# Altium project IoT_Project_V2.1.PrjPcb
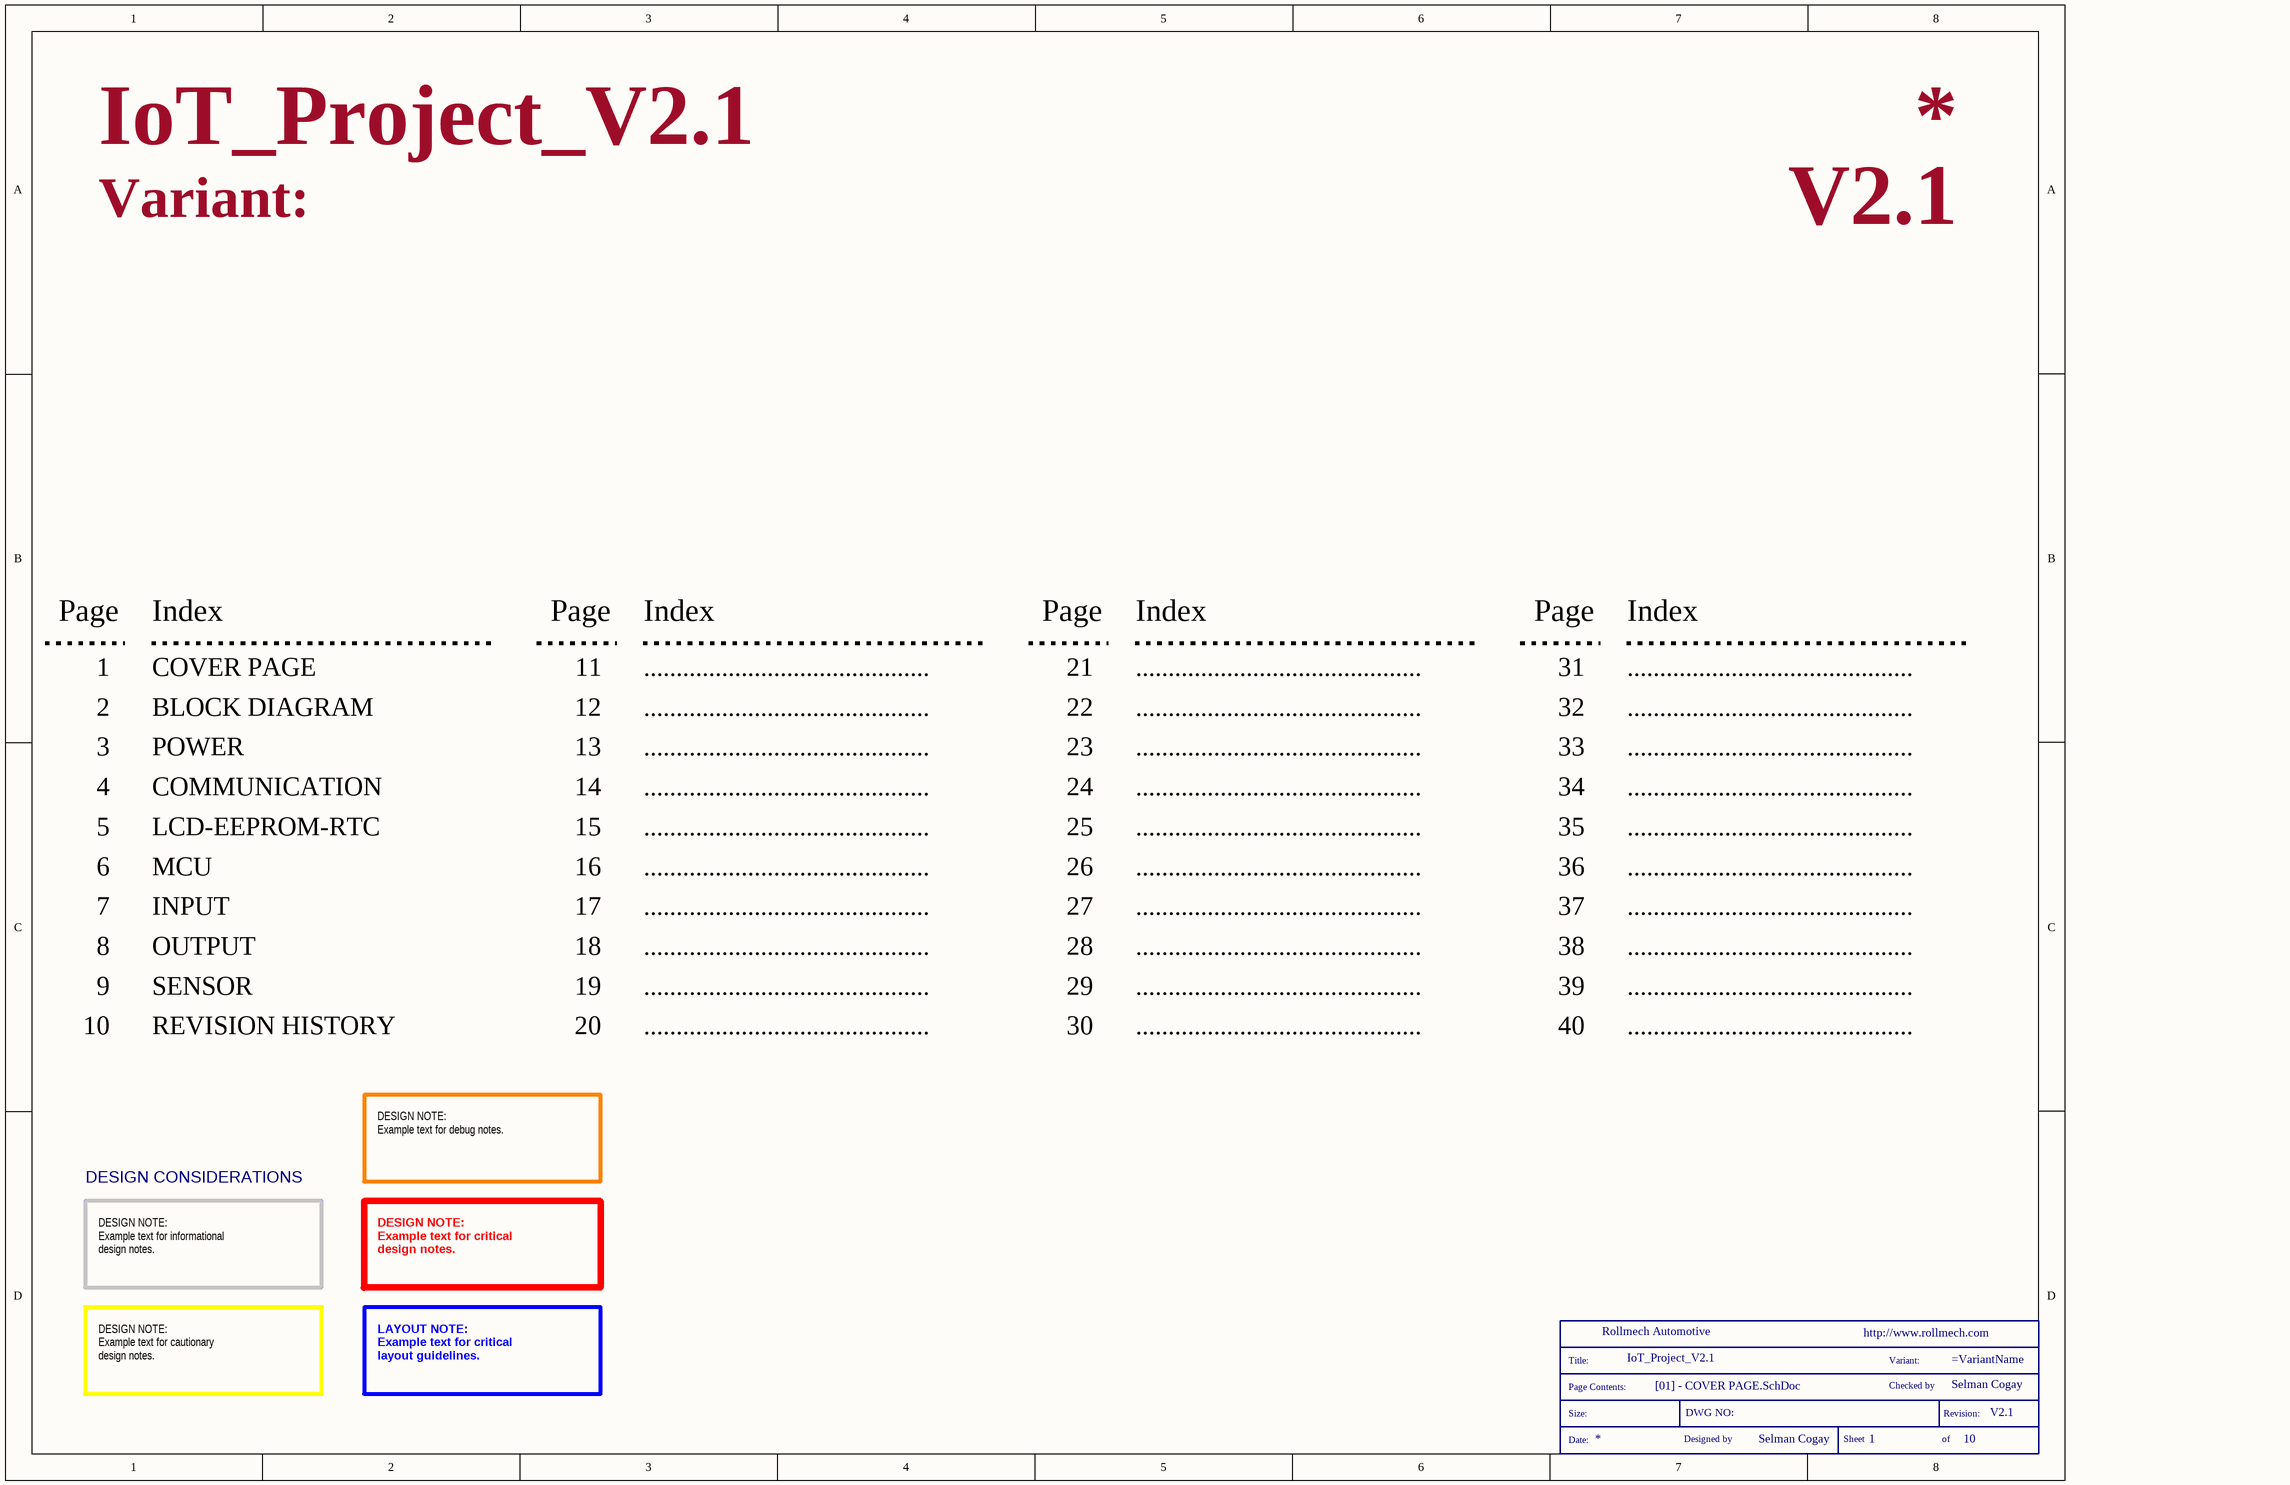
[diagram p0: [01] - COVER PAGE.SchDoc]
Company: Rollmech Automotive; Designer: Selman Cogay; Project: IoT_Project_V2.1; VersionRevision: V2.1; WebSite: http://www.rollmech.com
7 sheets, 165 parts. Net scope: flat (ports and power ports of the same name join across sheets).
Sheets:
  [01] - COVER PAGE.SchDoc
  [04] - COMMUNICATION.SchDoc
  [05] - LCD-EEPROM-RTC.SchDoc
  [06] - MCU.SchDoc
  [07] - INPUT.SchDoc
  [08] - OUTPUT.SchDoc
  [09] - SENSOR.SchDoc

## Sheet [01] - COVER PAGE.SchDoc
size A3; DocumentNumber: 1; SheetNumber: 1; SheetTotal: 10

### Parts
(Parts that share a designator on the sheet are numbered #1, #2 ... from top to bottom, then left to right.)
*#1  SCH_TITLE  (value not drawn)  (graphical)

### Notes on the sheet
- Variant:
- Page
- Index
- 1
- COVER PAGE
- 11
- ............................................
- 21
- 31
- 2
- 3
- BLOCK DIAGRAM
- POWER
- 12
- 13
- 22
- 23
- 32
- 33
- 4
- 5
- COMMUNICATION
- LCD-EEPROM-RTC
- 14
- 15
- 24
- 25
- 34
- 35
- 6
- MCU
- 16
- 26
- 36
- 7
- 8
- INPUT
- OUTPUT
- 17
- 18
- 27
- 28
- 37
- 38
- 9
- 10
- REVISION HISTORY
- SENSOR
- 19
- 20
- 29
- 30
- 39
- 40
- DESIGN NOTE:
  Example text for debug notes.
- DESIGN CONSIDERATIONS
- DESIGN NOTE:
  Example text for informational
  design notes.
- DESIGN NOTE:
  Example text for critical
  design notes.
- DESIGN NOTE:
  Example text for cautionary
  design notes.
- LAYOUT NOTE:
  Example text for critical
  layout guidelines.
- (in symbol SCH_TITLE) Title:; Variant:; Page Contents:; Checked by; Size:; DWG NO:; Revision:; Date:; Designed by; Sheet; of

### Library data of the parts
*#1 = SCH_TITLE: Schematic information

## Sheet [04] - COMMUNICATION.SchDoc
size A3; DocumentNumber: 4; SheetNumber: 4; SheetTotal: 10
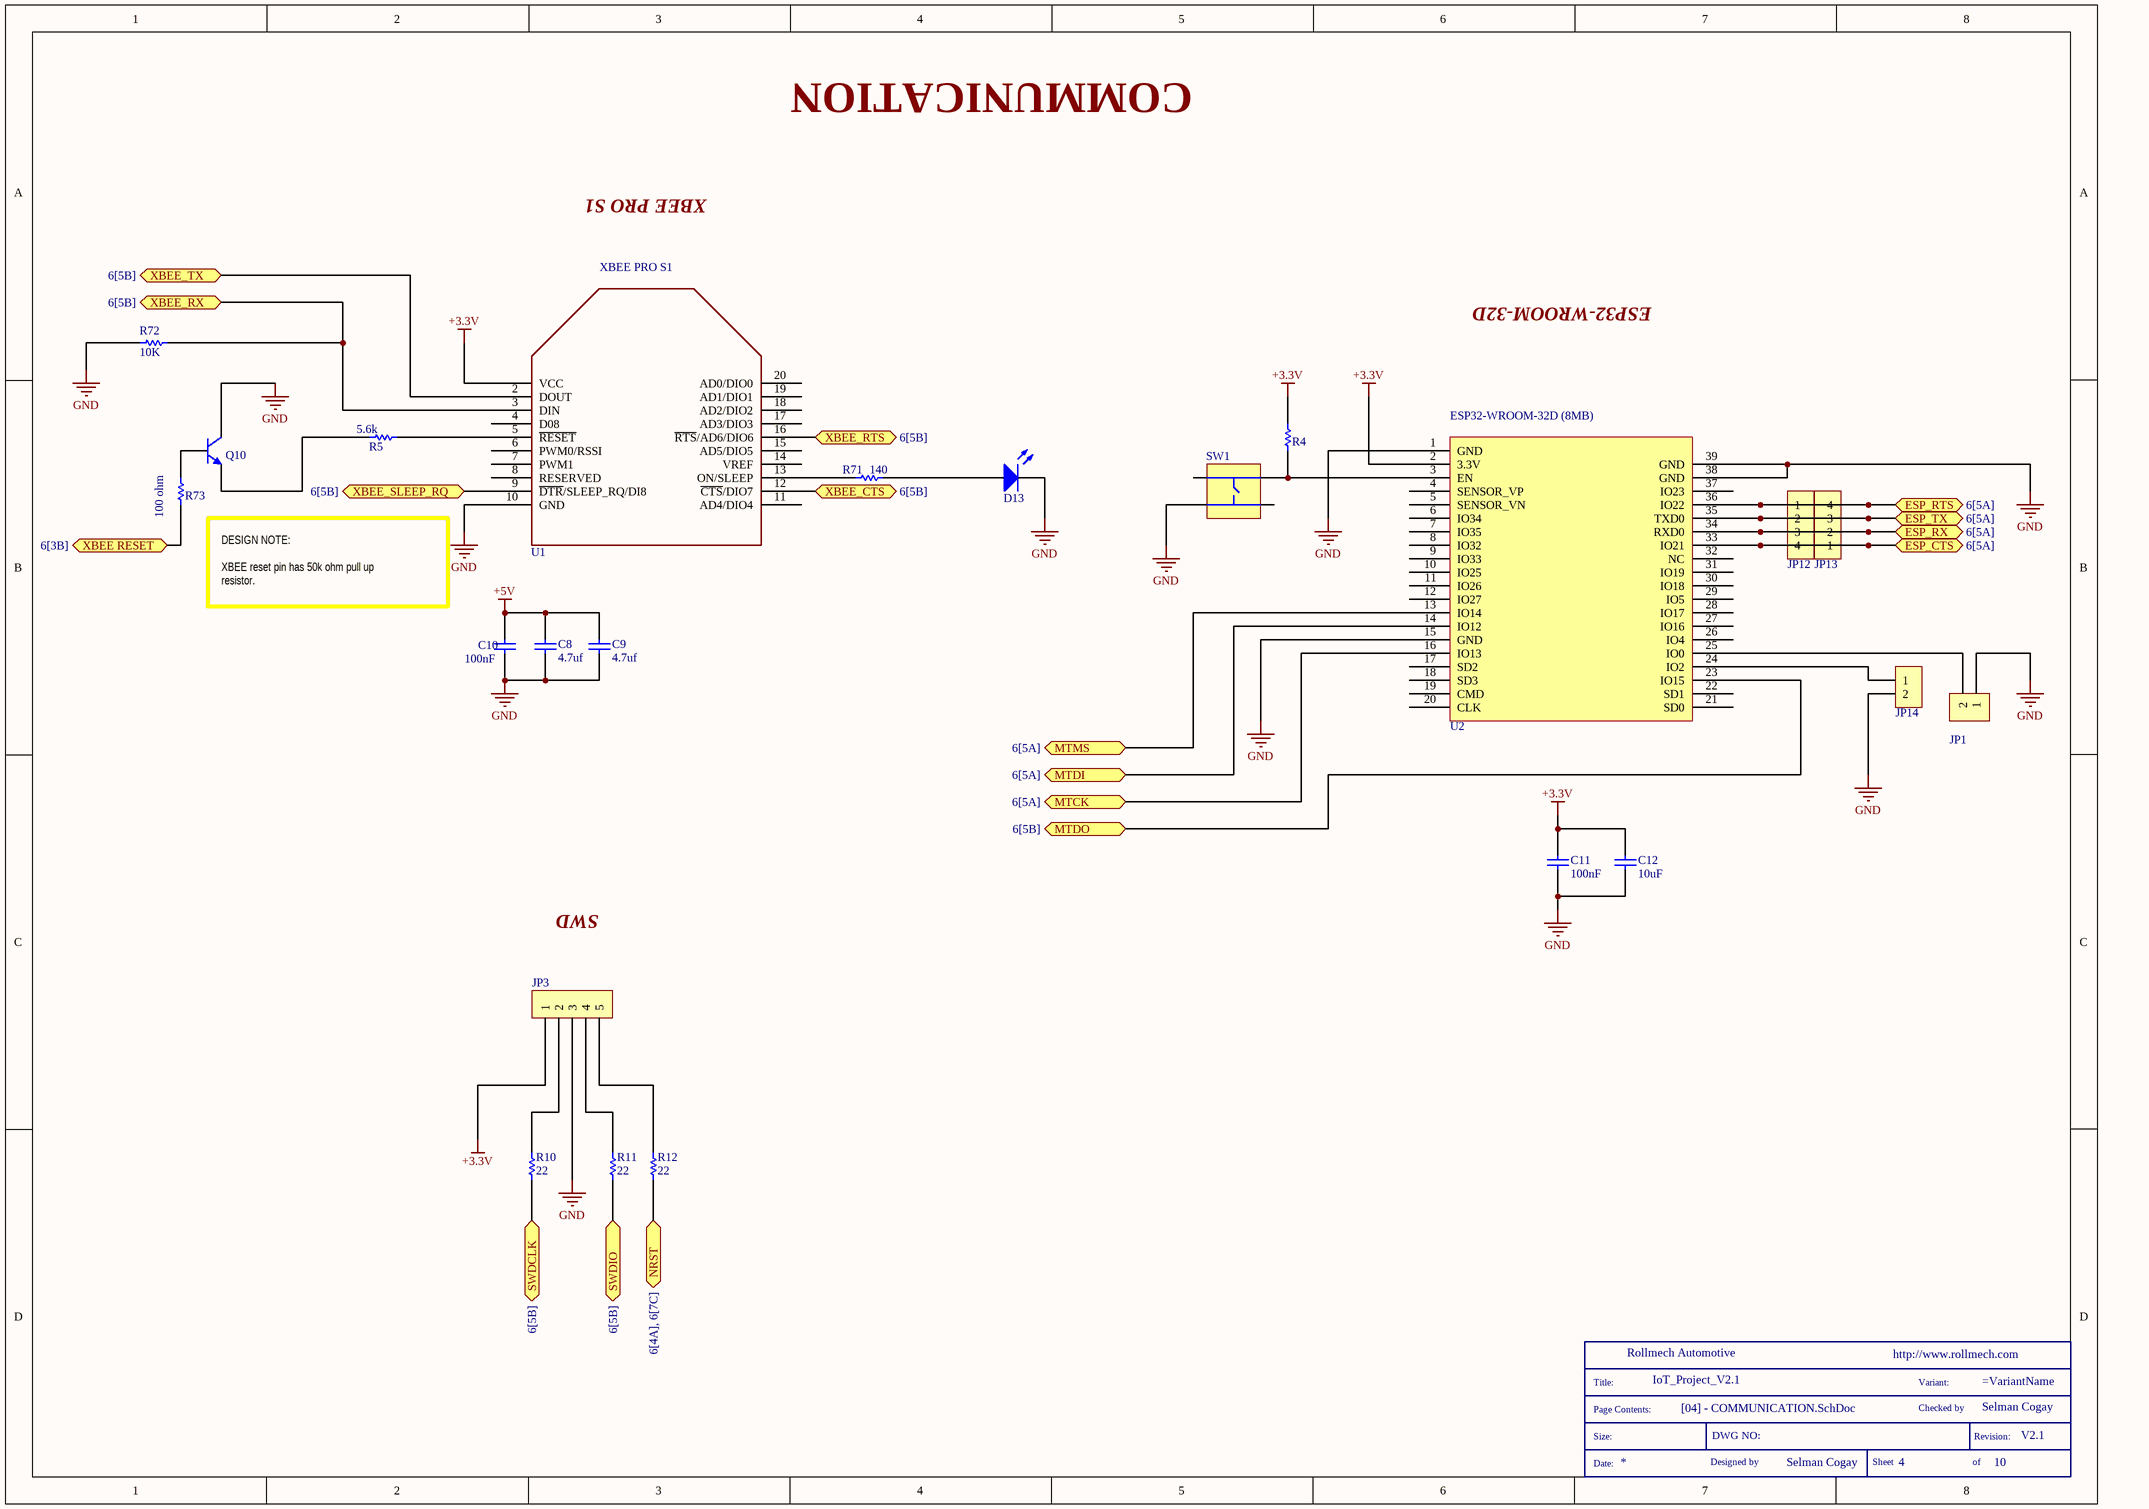
[diagram p1: [04] - COMMUNICATION.SchDoc]

### Parts
(Parts that share a designator on the sheet are numbered #1, #2 ... from top to bottom, then left to right.)
*#2  SCH_TITLE  (value not drawn)  (graphical)
C8  4.7uf  [CAP_CER_0603]
C9  4.7uf  [CAP_CER_0603]
C10  100nF  [CAP_CER_0603]
C11  100nF  [CAP_CER_0603]
C12  10uF  [CAP_CER_0805]
D13  Blue Led  [RES_0603]  (value not drawn)
JP1  HDR 1X2 2.54MM  [HDR_FEMALE_1X2_2.54MM]  (value not drawn)
JP3  HDR FEMALE 1X5 2.54MM  [HDR_FEMALE_1X5_2.54MM]  (value not drawn)
JP12  HDR FEMALE 1X4 2.54MM  [HDR_FEMALE_1X4_2.54MM]  (value not drawn)
JP13  HDR FEMALE 1X4 2.54MM  [HDR_FEMALE_1X4_2.54MM]  (value not drawn)
JP14  HDR 1X2 2.54MM  [HDR_FEMALE_1X2_2.54MM]  (value not drawn)
Q10  NPN 0.6A  [SOT-23 (TO-236)]  (value not drawn)
R4  1K 1/8W  [RES_0805]  (value not drawn)
R5  5.6k  [RES_0805]
R10  22  [RES_0805]
R11  22  [RES_0805]
R12  22  [RES_0805]
R71  140  [RES_0805]
R72  10K  [RES_0805]
R73  100 ohm  [RES_0805]
SW1  PTS 647 SK38 SMTR2 LFS  [4.5x4.5 Tactile switch]  (value not drawn)
U1  XBEE PRO S1  [XBEE PRO S1]
U2  ESP32-WROOM-32D (8MB)  [ESP32-WROOM-32D]

### Ports
ESP_CTS (see 6[5A]), ESP_RTS (see 6[5A]), ESP_RX (see 6[5A]), ESP_TX (see 6[5A]), MTCK (see 6[5A]), MTDI (see 6[5A]), MTDO (see 6[5B]), MTMS (see 6[5A]), NRST (see 6[4A], 6[7C]), SWDCLK (see 6[5B]), SWDIO (see 6[5B]), XBEE RESET (see 6[3B]), XBEE_CTS (see 6[5B]), XBEE_RTS (see 6[5B]), XBEE_RX (see 6[5B]), XBEE_SLEEP_RQ (see 6[5B]), XBEE_TX (see 6[5B])

### Nets
+3.3V: C11.2 C12.2 JP3.1 R4.2 U1.1(VCC) U2.2(3.3V)
+5V: C8.2 C9.2 C10.2
GND: C8.1 C9.1 C10.1 C11.1 C12.1 D13.2(K) JP1.1 JP3.3 JP14.2 Q10.1(C) R72.1 SW1.3 U1.10(GND) U2.1(GND) U2.15(GND) U2.38(GND) U2.39(GND)
NetD13_1: D13.1(A) R71.2
NetJP1_2: JP1.2 U2.25(IO0)
NetJP3_2: JP3.2 R10.2
NetJP3_4: JP3.4 R11.2
NetJP3_5: JP3.5 R12.2
NetJP12_1: JP12.1 JP13.4 U2.36(IO22) ; port ESP_RTS
NetJP12_2: JP12.2 JP13.3 U2.35(TXD0) ; port ESP_TX
NetJP12_3: JP12.3 JP13.2 U2.34(RXD0) ; port ESP_RX
NetJP12_4: JP12.4 JP13.1 U2.33(IO21) ; port ESP_CTS
NetJP14_1: JP14.1 U2.24(IO2)
NetQ10_2: Q10.2(B) R73.2
NetQ10_3: Q10.3(E) R5.2
NetR4_1: R4.1 SW1.2 U2.3(EN)
NetR5_1: R5.1 U1.5(~{RESET})
NetR10_1: R10.1 ; port SWDCLK
NetR11_1: R11.1 ; port SWDIO
NetR12_1: R12.1 ; port NRST
NetR71_1: R71.1 U1.13(ON/SLEEP)
NetR72_2: R72.2 U1.3(DIN) ; port XBEE_RX
NetR73_1: R73.1 ; port XBEE RESET
NetU1_2: U1.2(DOUT) ; port XBEE_TX
NetU1_9: U1.9(~{DTR}/SLEEP_RQ/DI8) ; port XBEE_SLEEP_RQ
NetU1_12: U1.12(~{CTS}/DIO7) ; port XBEE_CTS
NetU1_16: U1.16(~{RTS}/AD6/DIO6) ; port XBEE_RTS
NetU2_13: U2.13(IO14) ; port MTMS
NetU2_14: U2.14(IO12) ; port MTDI
NetU2_16: U2.16(IO13) ; port MTCK
NetU2_23: U2.23(IO15) ; port MTDO

Not connected (* = marked no-connect by the designer): SW1 1 4; U1 4(D08) 6(PWM0/RSSI) 7(PWM1) 8(RESERVED) 11(AD4/DIO4) 14(VREF) 15(AD5/DIO5) 17(AD3/DIO3) 18(AD2/DIO2) 19(AD1/DIO1) 20(AD0/DIO0); U2 4(SENSOR_VP) 5(SENSOR_VN) 6(IO34) 7(IO35) 8(IO32) 9(IO33) 10(IO25) 11(IO26) 12(IO27) 17(SD2) 18(SD3) 19(CMD) 20(CLK) 21(SD0) 22(SD1) 26(IO4) 27(IO16) 28(IO17) 29(IO5) 30(IO18) 31(IO19) 32(NC) 37(IO23)

### Notes on the sheet
- COMMUNICATION
- XBEE PRO S1
- ESP32-WROOM-32D
- DESIGN NOTE:
  XBEE reset pin has 50k ohm pull up resistor.
- SWD
- (in symbol SCH_TITLE) Title:; Variant:; Page Contents:; Checked by; Size:; DWG NO:; Revision:; Date:; Designed by; Sheet; of

### Library data of the parts
*#2 = SCH_TITLE: Schematic information
C8 C9 = CGA3E2C0G1H4R7C080AA: CAP CER 4.7PF 50V C0G 0603; Manufacturer 1: TDK Corporation; Category: Ceramic Capacitors; Manufacturer Part Number 1: CGA3E2C0G1H4R7C080AA; Case/Package: 0603 (1608 Metric); Quantity: 1; Supplier 1: Digikey; Supplier Part Number 1: 445-5621-1-ND; Supplier Stock 1: 68332; Supplier Unit Price 1: 0.19; Supplier Currency 1: $
C10 C11 = GMK107BJ104KAHT: CAP CER 100nf 35V X5R 0603; Manufacturer 1: Taiyo Yuden; Category: Ceramic Capacitors; Manufacturer Part Number 1: GMK107BJ104KAHT; Case/Package: 0603 (1608 Metric); Quantity: 1; Supplier 1: Digikey; Supplier Part Number 1: 587-3357-1-ND; Supplier Order Qty 1: 1; Supplier Stock 1: 97932; Supplier Unit Price 1: 0,14; Supplier Currency 1: $
C12 = CGA4J1X5R1C106M125AC: CAP CER 10UF 16V; Manufacturer 1: TDK Corporation; Category: Ceramic Capacitors; Manufacturer Part Number 1: CGA4J1X5R1C106M125AC; Case/Package: 0805 (2012 Metric); Quantity: 1; Supplier 1: Digikey; Supplier Part Number 1: 445-12654-1-ND; Supplier Order Qty 1: 1; Supplier Stock 1: 39905; Supplier Unit Price 1: 0,5; Supplier Currency 1: $
D13 = EAST16084BA8: LED BLUE CLEAR 2SMD; Manufacturer 1: Everlight Electronics Co Ltd; Category: LED Indication - Discrete; Manufacturer Part Number 1: EAST16084BA8; Case/Package: 0603 (1608 Metric); Quantity: 1; Supplier 1: Digikey; Supplier Part Number 1: 1080-1562-1-ND; Supplier Stock 1: 11914; Supplier Unit Price 1: 0.30; Supplier Currency 1: $
JP1 JP14 = PPTC021LFBN-RC: HDR FEMALE 1X2 2.54MM; Manufacturer 1: Sullins Connector Solutions; Category: Rectangular Connectors - Headers, Receptacles, Female Sockets; Manufacturer Part Number 1: PPTC021LFBN-RC; Case/Package: 2POS_2.54mmPitch; Quantity: 1; Supplier 1: Digikey; Supplier Part Number 1: S7000-ND; Supplier Order Qty 1: 1; Supplier Stock 1: 46723; Supplier Unit Price 1: 0,32; Supplier Currency 1: $
JP3 = PPTC051LFBN-RC: Manufacturer 1: Sullins Connector Solutions; Category: Rectangular Connectors - Headers, Receptacles, Female Sockets; Manufacturer Part Number 1: PPTC051LFBN-RC; Case/Package: 5Pos_2.5mm_Pitch; Quantity: 1; Supplier 1: Digikey; Supplier Part Number 1: S6103-ND; Supplier Order Qty 1: 1; Supplier Stock 1: 28189; Supplier Unit Price  1: 0,47; Supplier Currency 1: $
JP12 JP13 = PPTC041LFBN-RC: Manufacturer 1: Sullins Connector Solutions; Category: Rectangular Connectors - Headers, Receptacles, Female Sockets; Case/Package: 4POS_2.54mmPitch; Manufacturer Part Number 1: PPTC041LFBN-RC; Quantity: 1; Supplier 1: Digikey; Supplier Part Number 1: S7002-ND; Supplier Order Qty 1: 1; Supplier Stock 1: 30769; Supplier Unit Price 1: 0,45; Supplier Currency 1: $
Q10 = MMBT2222A-7-F: TRANS NPN 40V 0.6A SMD SOT23-3; Manufacturer 1: Diodes Incorporated; Category: Transistors - Bipolar (BJT) - Single; Manufacturer Part Number 1: MMBT2222A-7-F; Case/Package: SOT-23-3; Quantity: 1; Supplier 1: Digikey; Supplier Part Number 1: MMBT2222A-FDICT-ND; Supplier Order Qty 1: 1; Supplier Stock 1: 1957039; Supplier Unit Price 1: 0,14; Supplier Currency 1: $
R4 = ERJ-6ENF1001V: RES SMD 1K OHM; Manufacturer 1: Panasonic Electronic Components; Category: Chip Resistor - Surface Mount; Manufacturer Part Number 1: ERJ-6ENF1001V; Case/Package: 0805 (2012 Metric); Quantity: 1; Supplier 1: Digikey; Supplier Part Number 1: P1.00KCCT-ND; Supplier Order Qty 1: 1; Supplier Stock 1: 1361018; Supplier Unit Price 1: 0,1; Supplier Currency 1: $
R5 = ERJ-6ENF5601V: RES SMD 5.6K OHM 1% 1/8W 0805; Manufacturer 1: Panasonic Electronic Components; Category: Chip Resistor - Surface Mount; Manufacturer Part Number 1: ERJ-6ENF5601V; Case/Package: 0805 (2012 Metric); Quantity: 1; Supplier 1: Digikey; Supplier Part Number 1: P5.60KCCT-ND; Supplier Order Qty 1: 1; Supplier Stock 1: 71341; Supplier Unit Price 1: 0,1; Supplier Currency 1: $
R10-R12 = ERJ-6GEYJ220V: RES SMD 22 OHM 5% 1/8W 0805; Manufacturer 1: Panasonic Electronic Components; Category: Chip Resistor - Surface Mount; Manufacturer Part Number 1: ERJ-6GEYJ220V; Case/Package: 0805; Quantity: 1; Supplier 1: Digikey; Supplier Part Number 1: P22ACT-ND; Supplier Stock 1: 247578; Supplier Unit Price 1: 0.1; Supplier Currency 1: $
R71 = ERJ-6ENF1400V: RES SMD 140 OHM 1% 1/8W 0805; Manufacturer 1: Panasonic Electronic Components; Category: Chip Resistor - Surface Mount; Manufacturer Part Number 1: ERJ-6ENF1400V; Case/Package: 0805 (2012 Metric); Quantity: 1; Supplier 1: Digikey; Supplier Part Number 1: P140CCT-ND; Supplier Order Qty 1: 1; Supplier Stock 1: 76818; Supplier Unit Price 1: 0,1; Supplier Currency 1: $
R72 = ERJ-6ENF1002V: RES SMD 10K OHM 1% 1/8W 0805; Manufacturer 1: Panasonic Electronic Components; Category: Chip Resistor - Surface Mount; Manufacturer Part Number 1: ERJ-6ENF1002V; Case/Package: 0805 (2012 Metric); Quantity: 1; Supplier 1: Digikey; Supplier Part Number 1: P10.0KCCT-ND; Supplier Order Qty 1: 1; Supplier Stock 1: 2515107; Supplier Unit Price 1: 0,1; Supplier Currency 1: $
R73 = ERJ-6ENF1000V: RES SMD 100 OHM; Manufacturer 1: Panasonic Electronic Components; Category: Chip Resistor - Surface Mount; Manufacturer Part Number 1: ERJ-6ENF1000V; Case/Package: 0805 (2012 Metric); Quantity: 1; Supplier 1: Digikey; Supplier Part Number 1: P100CCT-ND; Supplier Order Qty 1: 1; Supplier Stock 1: 728141; Supplier Unit Price 1: 0,1; Supplier Currency 1: $
SW1 = PTS 647 SK38 SMTR2 LFS: SWITCH TACTILE 4.5 X 4.5; Manufacturer 1: C&K; Category: Tactile Switches; Manufacturer Part Number 1: PTS 647 SK38 SMTR2 LFS; Case/Package: 4.50mm x 4.50mm; Quantity: 1; Supplier 1: Digikey; Supplier Part Number 1: PTS647SK38SMTR2LFSCT-ND; Supplier Stock 1: 73195; Supplier Unit Price 1: 0.14; Supplier Currency 1: $
U1 = XBP24-DKSJ: XBEE PRO SERIES1; Manufacturer 1: Digi International; Category: RF Evaluation and Development Kits, Boards; Manufacturer Part Number 1: XBP24-DKSJ; Case/Package: THT; Quantity: 1; Supplier 1: Digikey; Supplier Part Number 1: 602-1590-ND; Supplier Stock 1: 0; Supplier Unit Price 1: -; Supplier Currency 1: $
U2 = ESP32-WROOM-32D (8MB): ESP32 WIFI MODULE 64MBITS SPI FLASH; Manufacturer 1: Espressif Systems; Category: RF Transceiver Modules; Manufacturer Part Number 1: ESP32-WROOM-32D (8MB); Case/Package: SMD; Quantity: 1; Supplier 1: Digikey; Supplier Part Number 1: 1904-1024-1-ND; Supplier Stock 1: 1298; Supplier Unit Price 1: 4.2; Supplier Currency 1: $

## Sheet [05] - LCD-EEPROM-RTC.SchDoc
size A3; DocumentNumber: 5; SheetNumber: 5; SheetTotal: 10
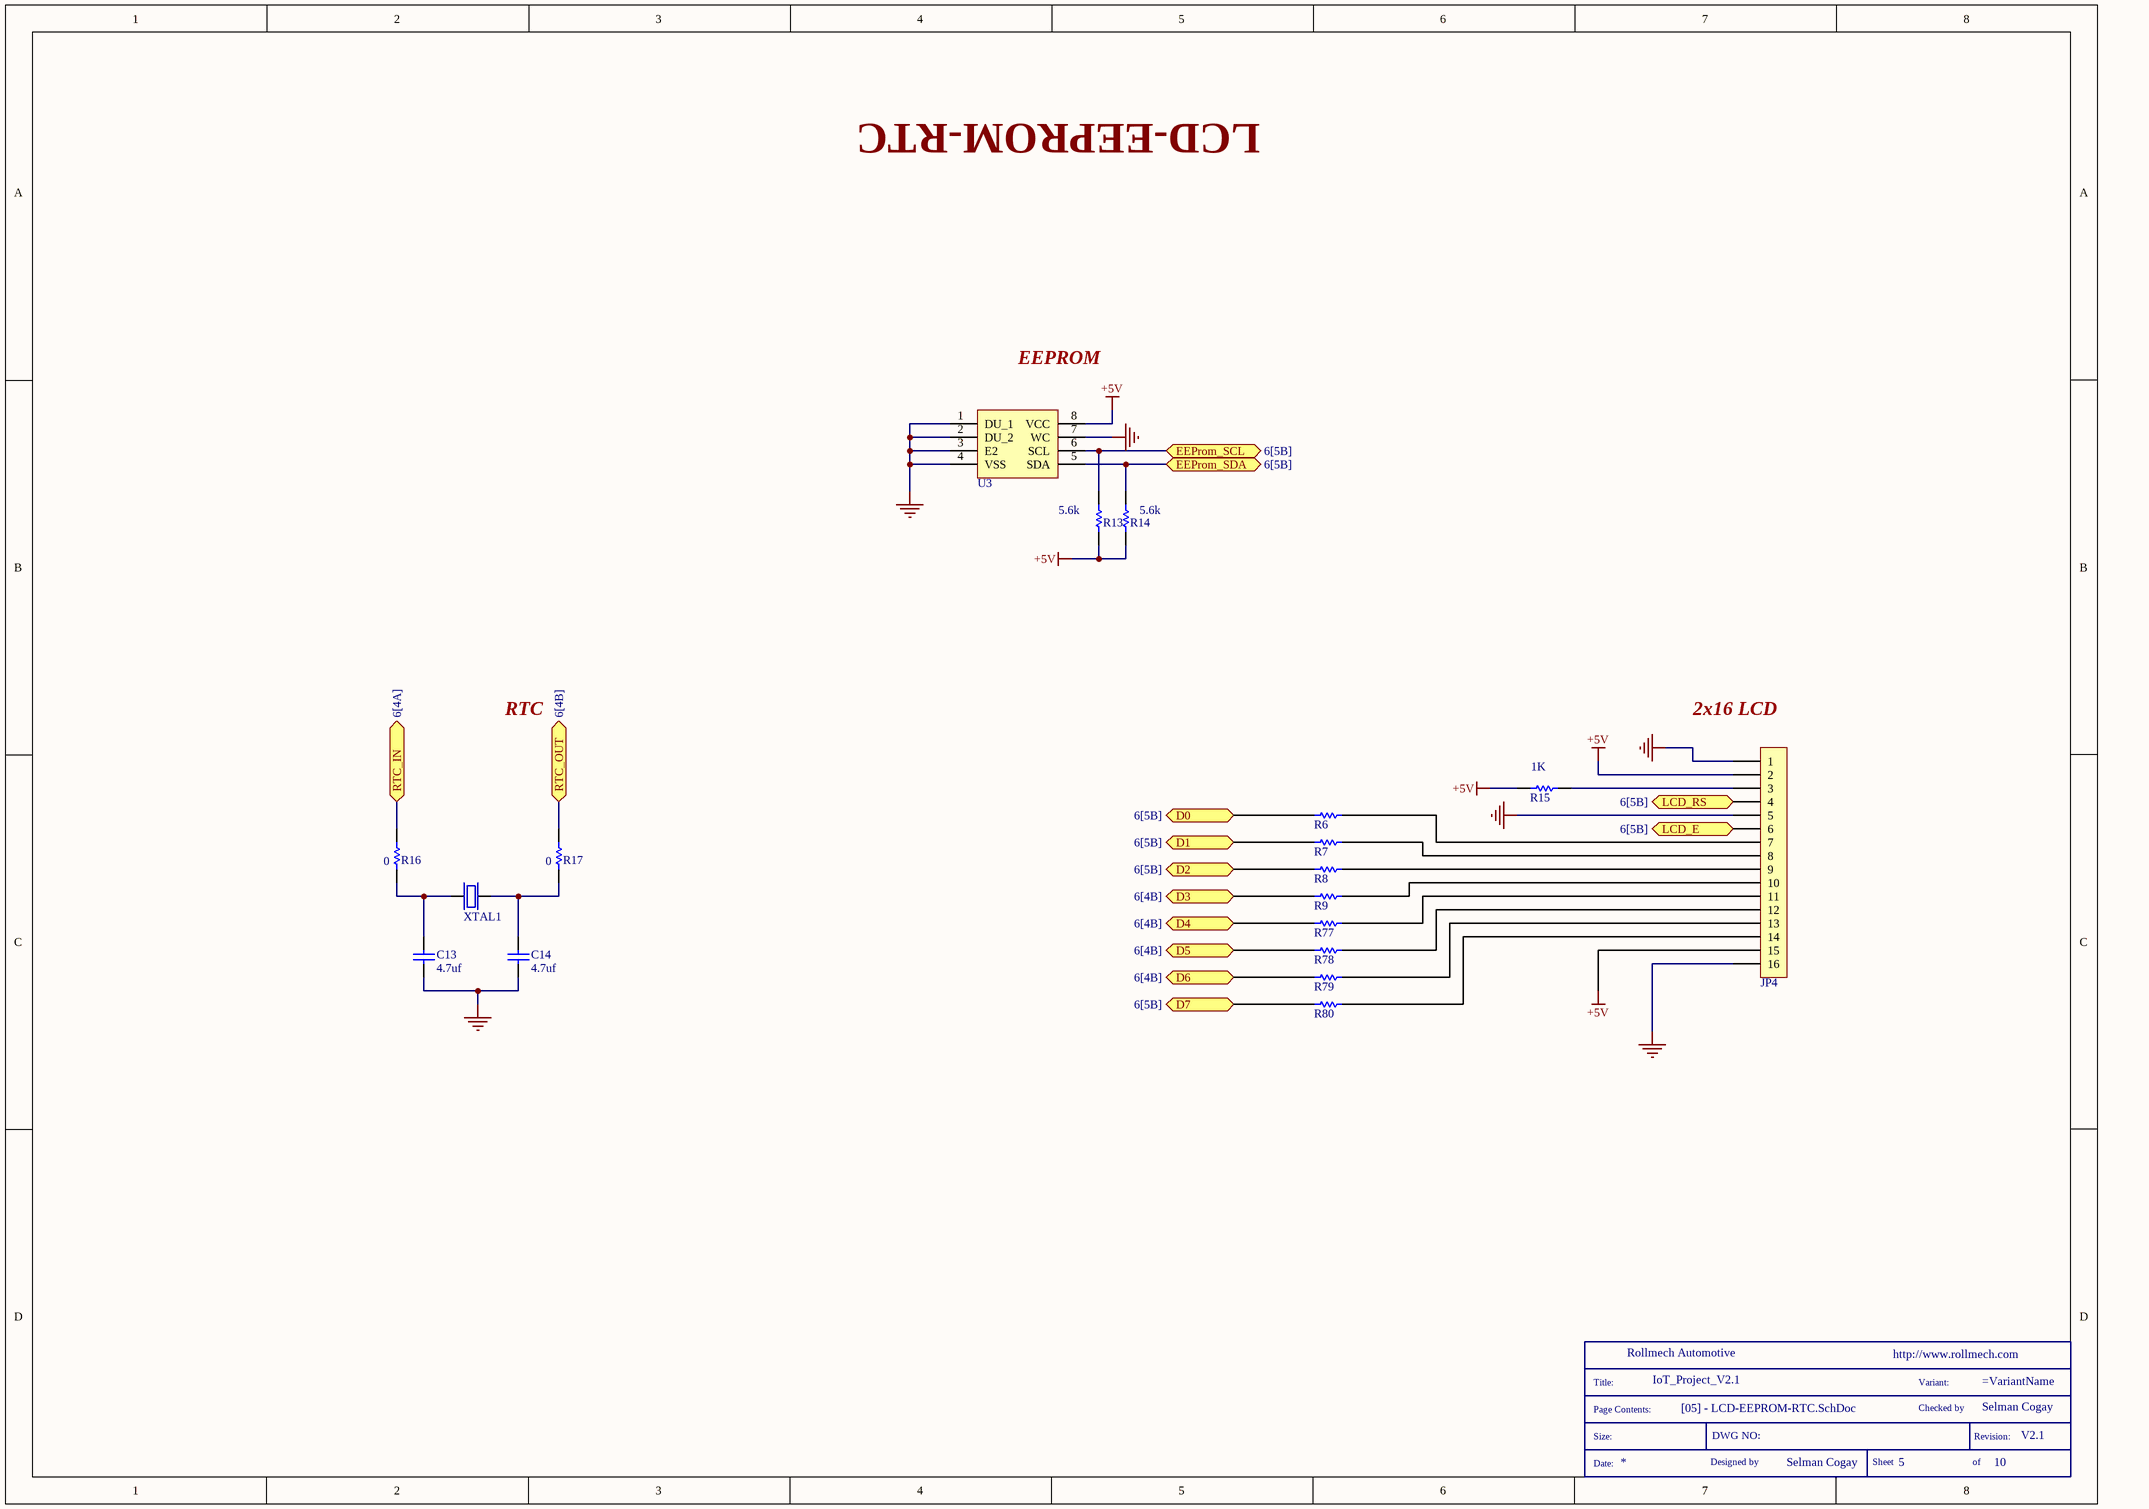
[diagram p2: [05] - LCD-EEPROM-RTC.SchDoc]

### Parts
(Parts that share a designator on the sheet are numbered #1, #2 ... from top to bottom, then left to right.)
*#3  SCH_TITLE  (value not drawn)  (graphical)
C13  4.7uf  [CAP_CER_0603]
C14  4.7uf  [CAP_CER_0603]
JP4  HDR FEMALE 1x16 2.54MM  [HDR_FEMALE_1x16_2.54MM]  (value not drawn)
R6  0 1/8W  [RES_0805]  (value not drawn)
R7  0 1/8W  [RES_0805]  (value not drawn)
R8  0 1/8W  [RES_0805]  (value not drawn)
R9  0 1/8W  [RES_0805]  (value not drawn)
R13  5.6k  [RES_0805]
R14  5.6k  [RES_0805]
R15  1K  [RES_0805]
R16  0  [RES_0805]
R17  0  [RES_0805]
R77  0 1/8W  [RES_0805]  (value not drawn)
R78  0 1/8W  [RES_0805]  (value not drawn)
R79  0 1/8W  [RES_0805]  (value not drawn)
R80  0 1/8W  [RES_0805]  (value not drawn)
U3  2M EEPROM  [SOIC-8]  (value not drawn)
XTAL1  32.768KHZ  [XTAL_2SMD]  (value not drawn)

### Ports
D0 (see 6[5B]), D1 (see 6[5B]), D2 (see 6[5B]), D3 (see 6[4B]), D4 (see 6[4B]), D5 (see 6[4B]), D6 (see 6[4B]), D7 (see 6[5B]), EEProm_SCL (see 6[5B]), EEProm_SDA (see 6[5B]), LCD_E (see 6[5B]), LCD_RS (see 6[5B]), RTC_IN (see 6[4A]), RTC_OUT (see 6[4B])

### Nets
+5V: JP4.2 JP4.15 R13.1 R14.1 R15.1 U3.8(VCC)
GND: C13.1 C14.1 JP4.1 JP4.5 JP4.16 U3.1(DU_1) U3.2(DU_2) U3.3(E2) U3.4(VSS) U3.7(WC)
NetC13_2: C13.2 R16.1 XTAL1.1
NetC14_2: C14.2 R17.1 XTAL1.2
NetJP4_3: JP4.3 R15.2
NetJP4_4: JP4.4 ; port LCD_RS
NetJP4_6: JP4.6 ; port LCD_E
NetJP4_7: JP4.7 R6.2
NetJP4_8: JP4.8 R7.2
NetJP4_9: JP4.9 R8.2
NetJP4_10: JP4.10 R9.2
NetJP4_11: JP4.11 R77.2
NetJP4_12: JP4.12 R78.2
NetJP4_13: JP4.13 R79.2
NetJP4_14: JP4.14 R80.2
NetR6_1: R6.1 ; port D0
NetR7_1: R7.1 ; port D1
NetR8_1: R8.1 ; port D2
NetR9_1: R9.1 ; port D3
NetR13_2: R13.2 U3.6(SCL) ; port EEProm_SCL
NetR14_2: R14.2 U3.5(SDA) ; port EEProm_SDA
NetR16_2: R16.2 ; port RTC_IN
NetR17_2: R17.2 ; port RTC_OUT
NetR77_1: R77.1 ; port D4
NetR78_1: R78.1 ; port D5
NetR79_1: R79.1 ; port D6
NetR80_1: R80.1 ; port D7

### Notes on the sheet
- LCD-EEPROM-RTC
- EEPROM
- RTC
- 2x16 LCD
- (in symbol SCH_TITLE) Title:; Variant:; Page Contents:; Checked by; Size:; DWG NO:; Revision:; Date:; Designed by; Sheet; of

### Library data of the parts
*#3 = SCH_TITLE: Schematic information
C13 C14 = CGA3E2C0G1H4R7C080AA: as C8 on sheet [04] - COMMUNICATION; Category: Ceramic Capacitors; Manufacturer Part Number 1: CGA3E2C0G1H4R7C080AA; Case/Package: 0603 (1608 Metric); Quantity: 1; Supplier 1: Digikey; Supplier Part Number 1: 445-5621-1-ND; Supplier Stock 1: 68332; Supplier Unit Price 1: 0.19; Supplier Currency 1: $
JP4 = PPTC161LFBN-RC: Manufacturer 1: Sullins Connector Solutions; Category: Rectangular Connectors - Headers, Receptacles, Female Sockets; Manufacturer Part Number 1: PPTC161LFBN-RC; Case/Package: 16Pos_2.5mm_Pitch; Quantity: 1; Supplier 1: Digikey; Supplier Part Number 1: S7014-ND; Supplier Order Qty 1: 1; Supplier Stock 1: 9562; Supplier Unit Price  1: 0,98; Supplier Currency 1: $
R6-R9 R16 R17 R77-R80 = CRCW08050000Z0EA": RES SMD 0 OHM JUMPER 1/8W 0805; Manufacturer 1: Vishay Dale; Case/Package: 0805 (2012 Metric); Manufacturer Part Number 1: CRCW08050000Z0EA; Category: Chip Resistor - Surface Mount; Quantity: 1; Supplier 1: Digikey; Supplier Part Number 1: 541-0.0ACT-ND; Supplier Stock 1: 746599; Supplier Unit Price 1: 0.1; Supplier Currency 1: $
R13 R14 = ERJ-6ENF5601V: as R5 on sheet [04] - COMMUNICATION; Category: Chip Resistor - Surface Mount; Manufacturer Part Number 1: ERJ-6ENF5601V; Case/Package: 0805 (2012 Metric); Quantity: 1; Supplier 1: Digikey; Supplier Part Number 1: P5.60KCCT-ND; Supplier Order Qty 1: 1; Supplier Stock 1: 71341; Supplier Unit Price 1: 0,1; Supplier Currency 1: $
R15 = ERJ-6ENF1001V: as R4 on sheet [04] - COMMUNICATION; Category: Chip Resistor - Surface Mount; Manufacturer Part Number 1: ERJ-6ENF1001V; Case/Package: 0805 (2012 Metric); Quantity: 1; Supplier 1: Digikey; Supplier Part Number 1: P1.00KCCT-ND; Supplier Order Qty 1: 1; Supplier Stock 1: 1361018; Supplier Unit Price 1: 0,1; Supplier Currency 1: $
U3 = M24M02-DWMN3TP/K: IC EEPROM 2M I2C 1MHZ 8SO; Manufacturer 1: STMicroelectronics; Category: Memory; Manufacturer Part Number 1: M24M02-DWMN3TP/K; Case/Package: 8-SOIC (0.154", 3.90mm Width); Quantity: 1; Supplier 1: Digikey; Supplier Part Number 1: 497-16238-1-ND; Supplier Order Qty 1: 1; Supplier Stock 1: 6027; Supplier Unit Price 1: 3,28; Supplier Currency 1: $
XTAL1 = ECS-.327-6-34QCS-TR: CRYSTAL 32.768KHZ; Manufacturer 1: ECS Inc.; Category: Crystals; Manufacturer Part Number 1: ECS-.327-6-34QCS-TR; Case/Package: 2-SMD, No Lead; Quantity: 1; Supplier 1: Digikey; Supplier Part Number 1: XC2162CT-ND; Supplier Order Qty 1: 1; Supplier Stock 1: 1833; Supplier Unit Price 1: 0,83; Supplier Currency 1: $

## Sheet [06] - MCU.SchDoc
size A3; DocumentNumber: 6; SheetNumber: 6; SheetTotal: 10
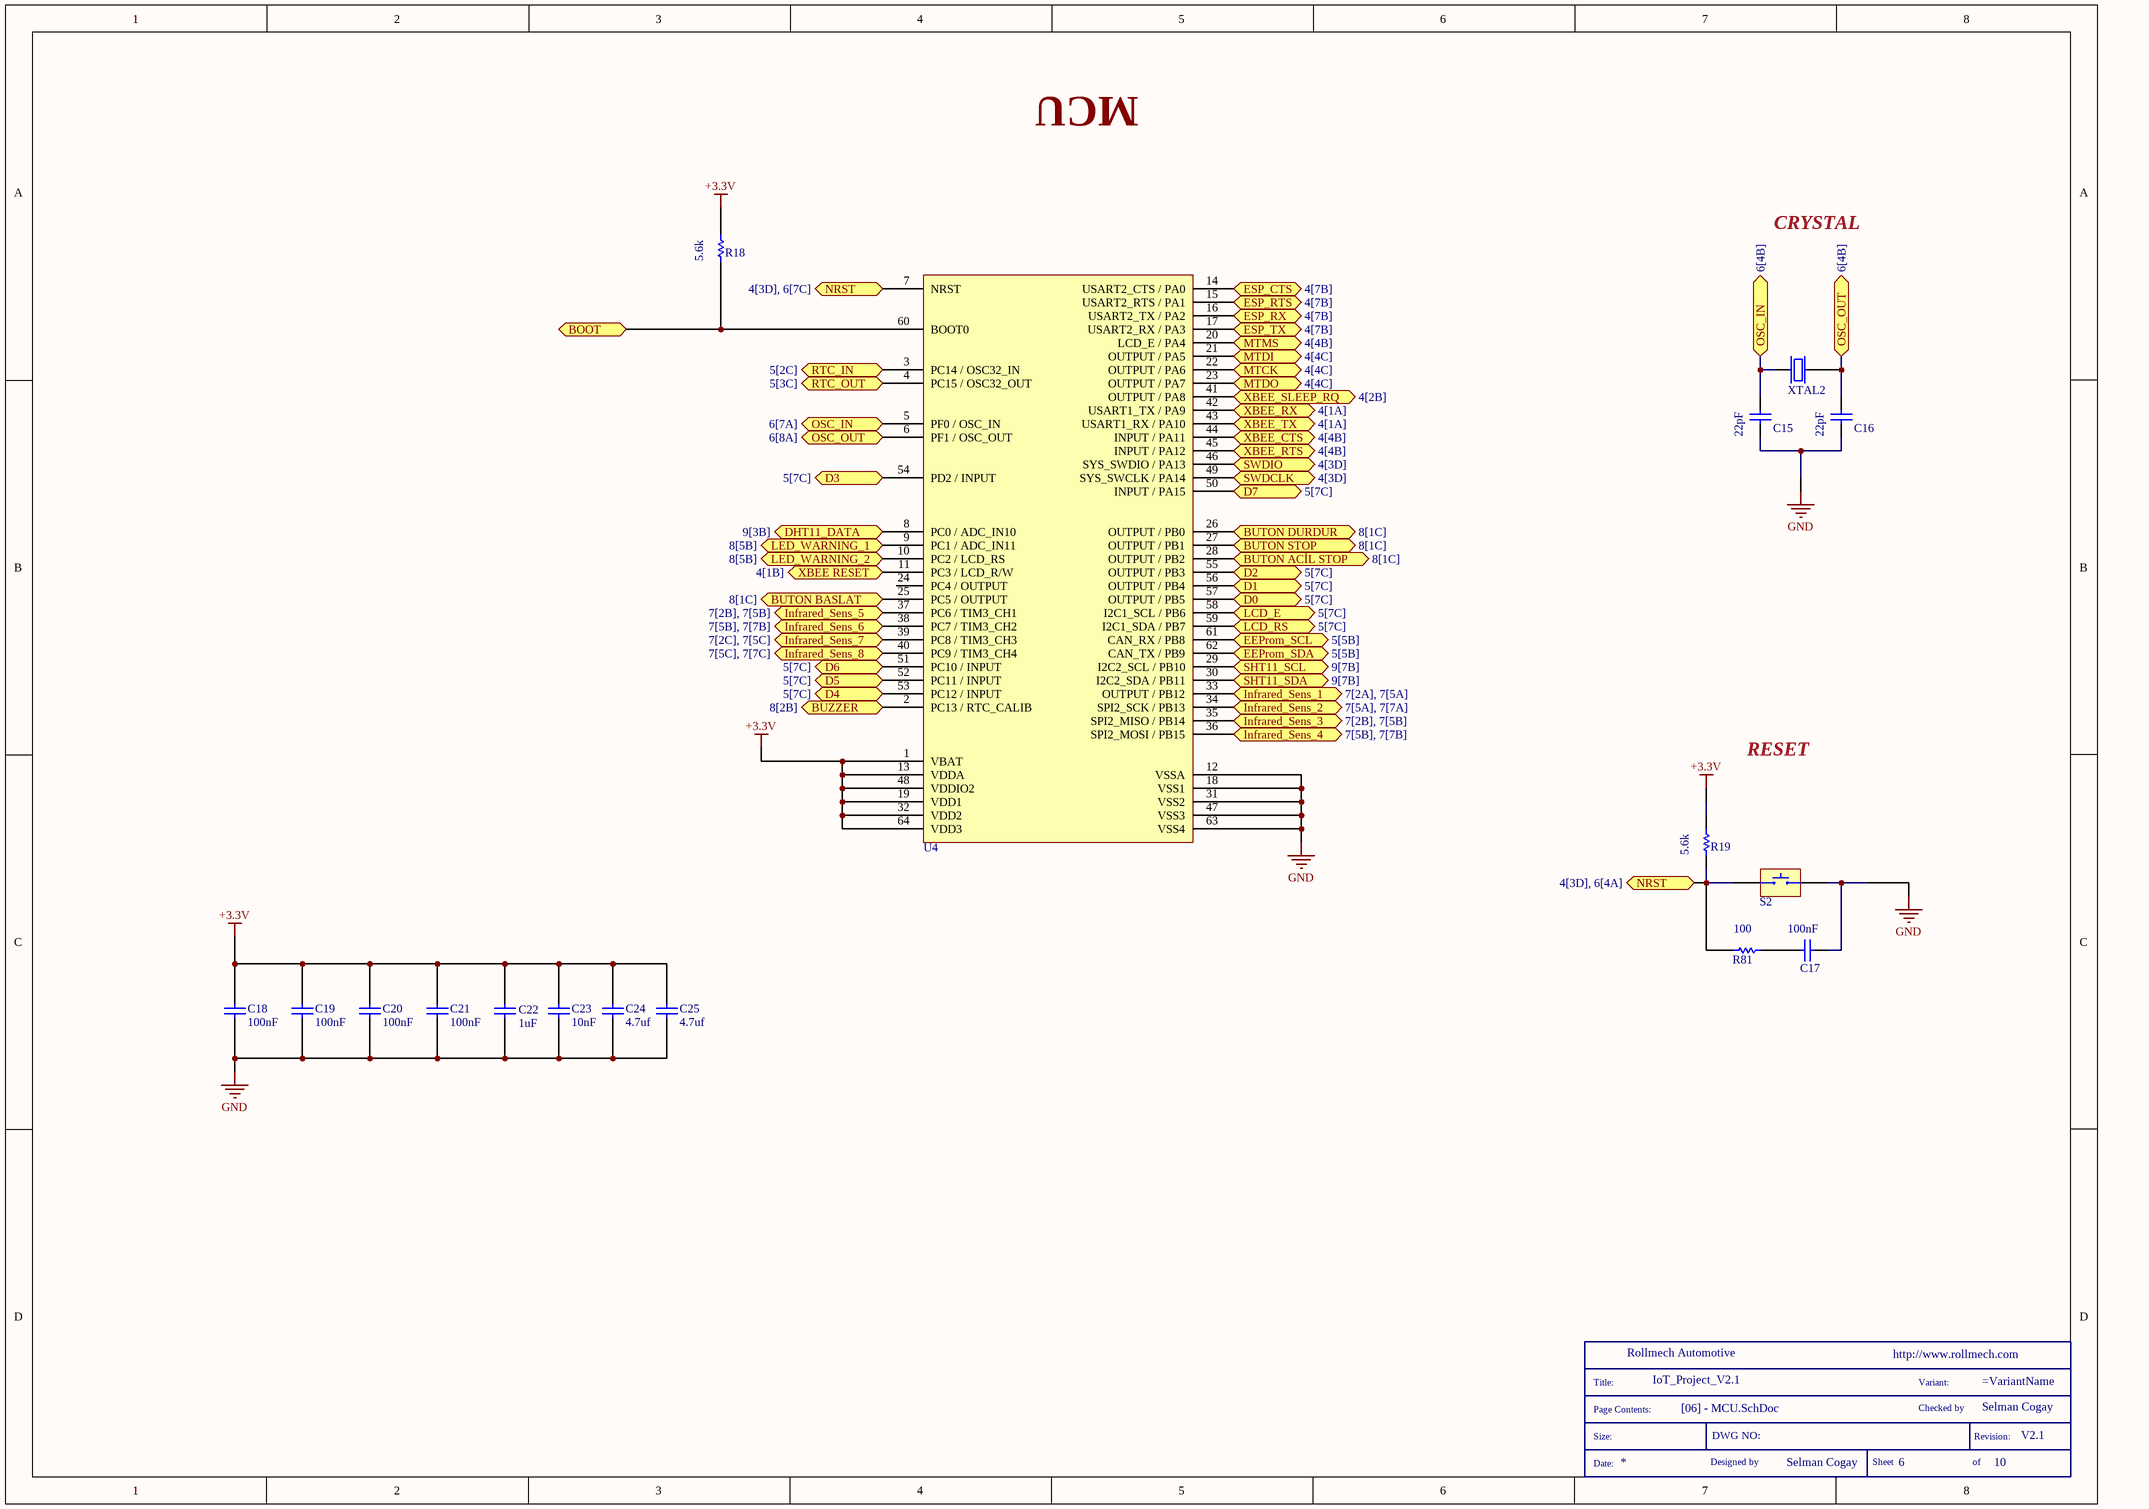
[diagram p3: [06] - MCU.SchDoc]

### Parts
(Parts that share a designator on the sheet are numbered #1, #2 ... from top to bottom, then left to right.)
*#4  SCH_TITLE  (value not drawn)  (graphical)
C15  22pF  [CAP_CER_0603]
C16  22pF  [CAP_CER_0603]
C17  100nF  [CAP_CER_0603]
C18  100nF  [CAP_CER_0603]
C19  100nF  [CAP_CER_0603]
C20  100nF  [CAP_CER_0603]
C21  100nF  [CAP_CER_0603]
C22  1uF  [CAP_CER_0603]
C23  10nF  [CAP_CER_0805]
C24  4.7uf  [CAP_CER_0603]
C25  4.7uf  [CAP_CER_0603]
R18  5.6k  [RES_0805]
R19  5.6k  [RES_0805]
R81  100  [RES_0805]
S2  TAC SW  [TAC-SW]  (value not drawn)
U4  STM32F072R8T6TR  [LQFP64]  (value not drawn)
XTAL2  8Mhz  [HC-49/US]  (value not drawn)

### Ports
BOOT, BUTON ACİL STOP (see 8[1C]), BUTON BASLAT (see 8[1C]), BUTON DURDUR (see 8[1C]), BUTON STOP (see 8[1C]), BUZZER (see 8[2B]), D0 (see 5[7C]), D1 (see 5[7C]), D2 (see 5[7C]), D3 (see 5[7C]), D4 (see 5[7C]), D5 (see 5[7C]), D6 (see 5[7C]), D7 (see 5[7C]), DHT11_DATA (see 9[3B]), EEProm_SCL (see 5[5B]), EEProm_SDA (see 5[5B]), ESP_CTS (see 4[7B]), ESP_RTS (see 4[7B]), ESP_RX (see 4[7B]), ESP_TX (see 4[7B]), Infrared_Sens_1 (see 7[2A], 7[5A]), Infrared_Sens_2 (see 7[5A], 7[7A]), Infrared_Sens_3 (see 7[2B], 7[5B]), Infrared_Sens_4 (see 7[5B], 7[7B]), Infrared_Sens_5 (see 7[2B], 7[5B]), Infrared_Sens_6 (see 7[5B], 7[7B]), Infrared_Sens_7 (see 7[2C], 7[5C]), Infrared_Sens_8 (see 7[5C], 7[7C]), LCD_E (see 5[7C]), LCD_RS (see 5[7C]), LED_WARNING_1 (see 8[5B]), LED_WARNING_2 (see 8[5B]), MTCK (see 4[4C]), MTDI (see 4[4C]), MTDO (see 4[4C]), MTMS (see 4[4B]), NRST (see 4[3D], 6[4A]), NRST (see 4[3D], 6[7C]), OSC_IN (see 6[4B]), OSC_IN (see 6[7A]), OSC_OUT (see 6[4B]), OSC_OUT (see 6[8A]), RTC_IN (see 5[2C]), RTC_OUT (see 5[3C]), SHT11_SCL (see 9[7B]), SHT11_SDA (see 9[7B]), SWDCLK (see 4[3D]), SWDIO (see 4[3D]), XBEE RESET (see 4[1B]), XBEE_CTS (see 4[4B]), XBEE_RTS (see 4[4B]), XBEE_RX (see 4[1A]), XBEE_SLEEP_RQ (see 4[2B]), XBEE_TX (see 4[1A])

### Nets
+3.3V: C18.2 C19.2 C20.2 C21.2 C22.2 C23.2 C24.2 C25.2 R18.2 R19.2 U4.1(VBAT) U4.13(VDDA) U4.19(VDD1) U4.32(VDD2) U4.48(VDDIO2) U4.64(VDD3)
GND: C15.1 C16.1 C17.2 C18.1 C19.1 C20.1 C21.1 C22.1 C23.1 C24.1 C25.1 S2.2 U4.12(VSSA) U4.18(VSS1) U4.31(VSS2) U4.47(VSS3) U4.63(VSS4)
NetC15_2: C15.2 U4.5(PF0_/_OSC_IN) XTAL2.1 ; port OSC_IN
NetC16_2: C16.2 U4.6(PF1_/_OSC_OUT) XTAL2.2 ; port OSC_OUT
NetC17_1: C17.1 R81.2
NetJP4_4: U4.59(I2C1_SDA_/_PB7) ; port LCD_RS
NetJP4_6: U4.58(I2C1_SCL_/_PB6) ; port LCD_E
NetJP6_2: U4.29(I2C2_SCL_/_PB10) ; port SHT11_SCL
NetJP6_3: U4.30(I2C2_SDA_/_PB11) ; port SHT11_SDA
NetJP7_2: U4.8(PC0_/_ADC_IN10) ; port DHT11_DATA
NetJP8_2: U4.2(PC13_/_RTC_CALIB) ; port BUZZER
NetJP9_1: U4.25(PC5_/_OUTPUT) ; port BUTON BASLAT
NetJP9_2: U4.26(OUTPUT_/_PB0) ; port BUTON DURDUR
NetJP9_3: U4.27(OUTPUT_/_PB1) ; port BUTON STOP
NetJP9_4: U4.28(OUTPUT_/_PB2) ; port BUTON ACİL STOP
NetJP12_1: U4.15(USART2_RTS_/_PA1) ; port ESP_RTS
NetJP12_2: U4.17(USART2_RX_/_PA3) ; port ESP_TX
NetJP12_3: U4.16(USART2_TX_/_PA2) ; port ESP_RX
NetJP12_4: U4.14(USART2_CTS_/_PA0) ; port ESP_CTS
NetQ11_2: U4.9(PC1_/_ADC_IN11) ; port LED_WARNING_1
NetQ12_2: U4.10(PC2_/_LCD_RS) ; port LED_WARNING_2
NetR6_1: U4.57(OUTPUT_/_PB5) ; port D0
NetR7_1: U4.56(OUTPUT_/_PB4) ; port D1
NetR8_1: U4.55(OUTPUT_/_PB3) ; port D2
NetR9_1: U4.54(PD2_/_INPUT) ; port D3
NetR10_1: U4.49(SYS_SWCLK_/_PA14) ; port SWDCLK
NetR11_1: U4.46(SYS_SWDIO_/_PA13) ; port SWDIO
NetR12_1: R19.1 R81.1 S2.1 U4.7(NRST) ; port NRST
NetR13_2: U4.61(CAN_RX_/_PB8) ; port EEProm_SCL
NetR14_2: U4.62(CAN_TX_/_PB9) ; port EEProm_SDA
NetR16_2: U4.3(PC14_/_OSC32_IN) ; port RTC_IN
NetR17_2: U4.4(PC15_/_OSC32_OUT) ; port RTC_OUT
NetR18_1: R18.1 U4.60(BOOT0) ; port BOOT
NetR20_1: U4.33(OUTPUT_/_PB12) ; port Infrared_Sens_1
NetR21_1: U4.34(SPI2_SCK_/_PB13) ; port Infrared_Sens_2
NetR32_1: U4.35(SPI2_MISO_/_PB14) ; port Infrared_Sens_3
NetR33_1: U4.36(SPI2_MOSI_/_PB15) ; port Infrared_Sens_4
NetR44_1: U4.37(PC6_/_TIM3_CH1) ; port Infrared_Sens_5
NetR45_1: U4.38(PC7_/_TIM3_CH2) ; port Infrared_Sens_6
NetR56_1: U4.39(PC8_/_TIM3_CH3) ; port Infrared_Sens_7
NetR57_1: U4.40(PC9_/_TIM3_CH4) ; port Infrared_Sens_8
NetR72_2: U4.42(USART1_TX_/_PA9) ; port XBEE_RX
NetR73_1: U4.11(PC3_/_LCD_R/W) ; port XBEE RESET
NetR77_1: U4.53(PC12_/_INPUT) ; port D4
NetR78_1: U4.52(PC11_/_INPUT) ; port D5
NetR79_1: U4.51(PC10_/_INPUT) ; port D6
NetR80_1: U4.50(INPUT_/_PA15) ; port D7
NetU1_2: U4.43(USART1_RX_/_PA10) ; port XBEE_TX
NetU1_9: U4.41(OUTPUT_/_PA8) ; port XBEE_SLEEP_RQ
NetU1_12: U4.44(INPUT_/_PA11) ; port XBEE_CTS
NetU1_16: U4.45(INPUT_/_PA12) ; port XBEE_RTS
NetU2_13: U4.20(LCD_E_/_PA4) ; port MTMS
NetU2_14: U4.21(OUTPUT_/_PA5) ; port MTDI
NetU2_16: U4.22(OUTPUT_/_PA6) ; port MTCK
NetU2_23: U4.23(OUTPUT_/_PA7) ; port MTDO

Not connected (* = marked no-connect by the designer): U4 24(PC4_/_OUTPUT)

### Notes on the sheet
- MCU
- CRYSTAL
- RESET
- (in symbol SCH_TITLE) Title:; Variant:; Page Contents:; Checked by; Size:; DWG NO:; Revision:; Date:; Designed by; Sheet; of

### Library data of the parts
*#4 = SCH_TITLE: Schematic information
C15 C16 = GCM1885C2A220FA16D: CAP CER 22PF 100V C0G/NP0 0603; Manufacturer 1: Murata Electronics North America; Category: Ceramic Capacitors; Manufacturer Part Number 1: GCM1885C2A220FA16D; Case/Package: 0603 (1608 Metric); Quantity: 1; Supplier 1: Digikey; Supplier Part Number 1: 490-16413-1-ND; Supplier Order Qty 1: 1; Supplier Stock 1: 22604; Supplier Unit Price 1: 0,22; Supplier Currency 1: $
C17-C21 = GMK107BJ104KAHT: as C10 on sheet [04] - COMMUNICATION; Category: Ceramic Capacitors; Manufacturer Part Number 1: GMK107BJ104KAHT; Case/Package: 0603 (1608 Metric); Quantity: 1; Supplier 1: Digikey; Supplier Part Number 1: 587-3357-1-ND; Supplier Order Qty 1: 1; Supplier Stock 1: 97932; Supplier Unit Price 1: 0,14; Supplier Currency 1: $
C22 = CGA3E3X5R1V105K080AB: CAP CER 1UF 35V; Manufacturer 1: TDK Corporation; Category: Ceramic Capacitors; Manufacture Part Number 1: CGA3E3X5R1V105K080AB; Case/Package: 0603 (1608 Metric); Quantity: 1; Supplier 1: Digikey; Supplier Part Number 1: 445-12484-1-ND; Supplier Order Qty 1: 1; Supplier Stock 1: 11910; Supplier Unit Price 1: 0,25; Supplier Currency 1: $
C23 = CL21B103KC6WPNC: CAP CER 10nF 100V; Manufacturer 1: Samsung Electro-Mechanics; Category: Ceramic Capacitors; Manufacturer Part Number 1: CL21B103KC6WPNC; Case/Package: 0805 (2012 Metric); Quantity: 1; Supplier 1: Digikey; Supplier Part Number 1: 1276-6845-1-ND; Supplier Order Qty 1: 1; Supplier Stock 1: 38701; Supplier Unit Price 1: 0,1; Supplier Currency 1: $
C24 C25 = CGA3E2C0G1H4R7C080AA: as C8 on sheet [04] - COMMUNICATION; Category: Ceramic Capacitors; Manufacturer Part Number 1: CGA3E2C0G1H4R7C080AA; Case/Package: 0603 (1608 Metric); Quantity: 1; Supplier 1: Digikey; Supplier Part Number 1: 445-5621-1-ND; Supplier Stock 1: 68332; Supplier Unit Price 1: 0.19; Supplier Currency 1: $
R18 R19 = ERJ-6ENF5601V: as R5 on sheet [04] - COMMUNICATION; Category: Chip Resistor - Surface Mount; Manufacturer Part Number 1: ERJ-6ENF5601V; Case/Package: 0805 (2012 Metric); Quantity: 1; Supplier 1: Digikey; Supplier Part Number 1: P5.60KCCT-ND; Supplier Order Qty 1: 1; Supplier Stock 1: 71341; Supplier Unit Price 1: 0,1; Supplier Currency 1: $
R81 = ERJ-6ENF1000V: as R73 on sheet [04] - COMMUNICATION; Category: Chip Resistor - Surface Mount; Manufacturer Part Number 1: ERJ-6ENF1000V; Case/Package: 0805 (2012 Metric); Quantity: 1; Supplier 1: Digikey; Supplier Part Number 1: P100CCT-ND; Supplier Order Qty 1: 1; Supplier Stock 1: 728141; Supplier Unit Price 1: 0,1; Supplier Currency 1: $
S2 = FSMSMTR: SWITCH TACTILE SPST-NO 0.05A 24V; Manufacturer 1: TE Connectivity ALCOSWITCH Switches; Category: Tactile Switches; Manufacturer Part Number 1: FSMSMTR; Case/Package: *; Quantity: 1; Supplier 1: Digikey; Supplier Part Number 1: 450-1758-1-ND; Supplier Order Qty 1: 1; Supplier Stock 1: 28743; Supplier Unit Price 1: 0,47; Supplier Currency 1: $
U4 = STM32F072R8T6TR: IC MCU 32BIT 64KB FLASH 64LQFP; Manufacturer 1: STMicroelectronics; Category: Embedded - Microcontrollers; Manufacture Part Number 1: STM32F072R8T6TR; Case/Package: 64-LQFP; Quantity: 1; Supplier 1: Digikey; Supplier Part Number 1: 497-17362-1-ND; Supplier Order Qty 1: 1; Supplier Stock 1: 441; Supplier Unit Price 1: 3,84; Supplier Currency 1: $
XTAL2 = ECS-80-18-5PLX-AGN-TR: CRYSTAL 8.000MHZ 18PF SMT; Manufacturer 1: ECS Inc.; Category: Crystals; Manufacturer Part Number 1: ECS-80-18-5PLX-AGN-TR; Case/Package: HC-49/US; Quantity: 1; Supplier 1: Digikey; Supplier Part Number 1: XC2782CT-ND; Supplier Stock 1: 1600; Supplier Unit Price 1: 0.37; Supplier Currency 1: $

## Sheet [07] - INPUT.SchDoc
size A3; DocumentNumber: 7; SheetNumber: 7; SheetTotal: 10
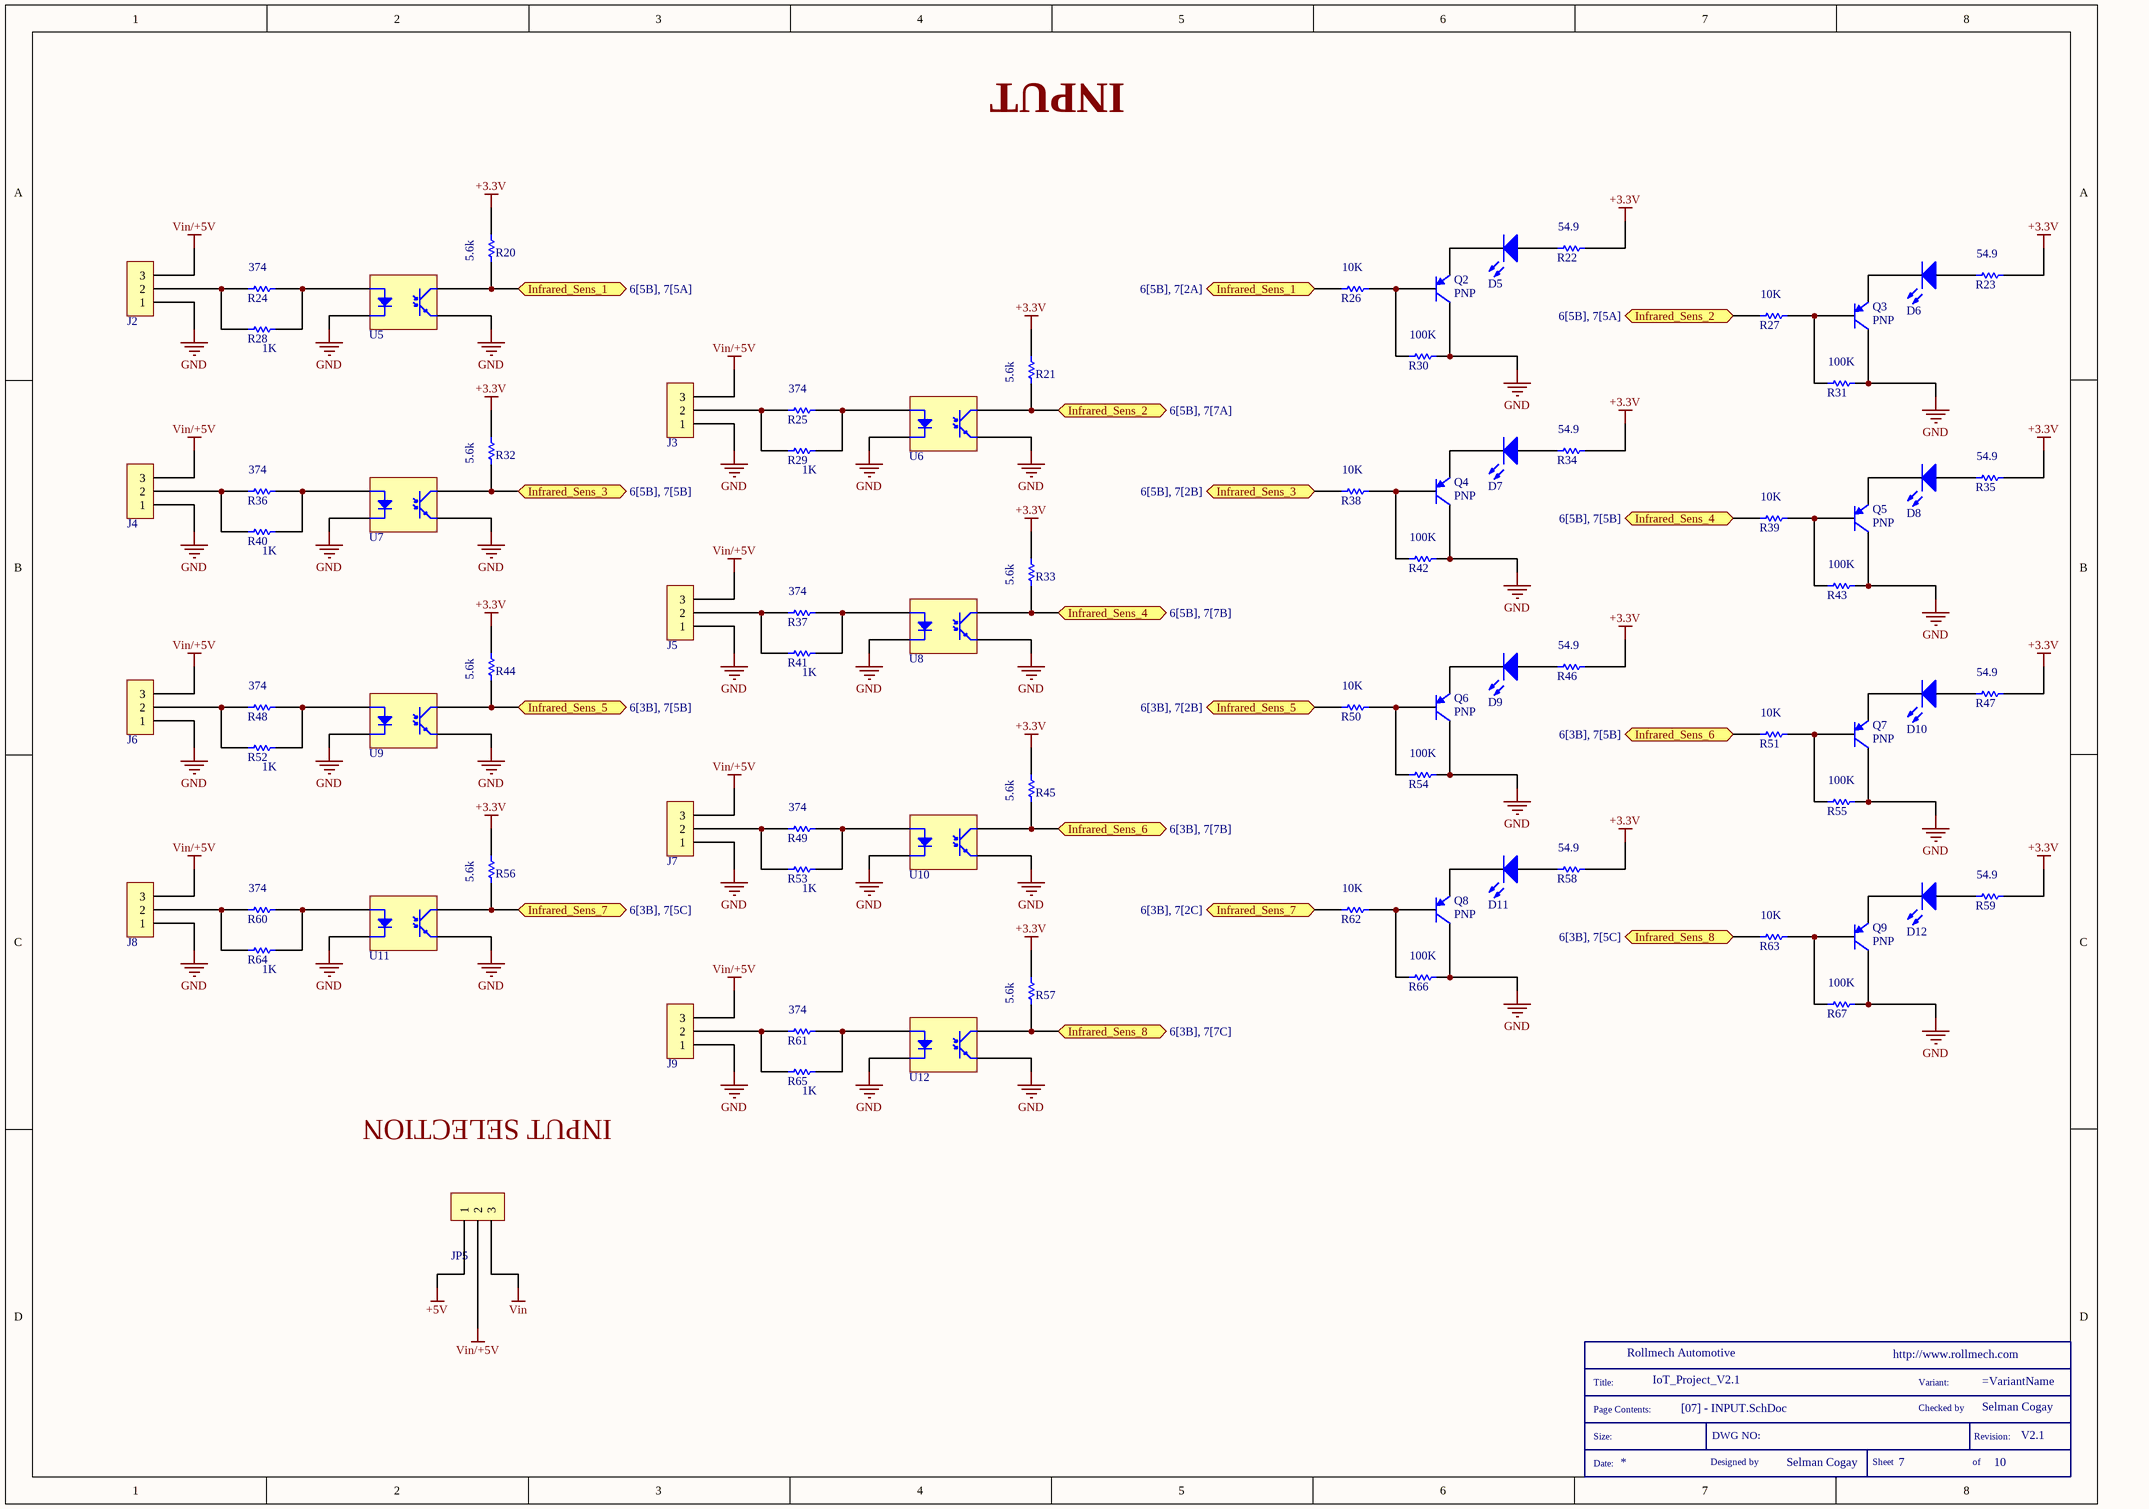
[diagram p4: [07] - INPUT.SchDoc]

### Parts
(Parts that share a designator on the sheet are numbered #1, #2 ... from top to bottom, then left to right.)
*#5  SCH_TITLE  (value not drawn)  (graphical)
D5  Blue Led  [RES_0603]  (value not drawn)
D6  Blue Led  [RES_0603]  (value not drawn)
D7  Blue Led  [RES_0603]  (value not drawn)
D8  Blue Led  [RES_0603]  (value not drawn)
D9  Blue Led  [RES_0603]  (value not drawn)
D10  Blue Led  [RES_0603]  (value not drawn)
D11  Blue Led  [RES_0603]  (value not drawn)
D12  Blue Led  [RES_0603]  (value not drawn)
J2  CONN 1X3 3MM  [CONN_MALE_1X3_3MM]  (value not drawn)
J3  CONN 1X3 3MM  [CONN_MALE_1X3_3MM]  (value not drawn)
J4  CONN 1X3 3MM  [CONN_MALE_1X3_3MM]  (value not drawn)
J5  CONN 1X3 3MM  [CONN_MALE_1X3_3MM]  (value not drawn)
J6  CONN 1X3 3MM  [CONN_MALE_1X3_3MM]  (value not drawn)
J7  CONN 1X3 3MM  [CONN_MALE_1X3_3MM]  (value not drawn)
J8  CONN 1X3 3MM  [CONN_MALE_1X3_3MM]  (value not drawn)
J9  CONN 1X3 3MM  [CONN_MALE_1X3_3MM]  (value not drawn)
JP5  HDR_1X3_2.54  [HDR_MALE_1X3_2.54MM]  (value not drawn)
Q2  PNP  [SOT-23 (TO-236)]
Q3  PNP  [SOT-23 (TO-236)]
Q4  PNP  [SOT-23 (TO-236)]
Q5  PNP  [SOT-23 (TO-236)]
Q6  PNP  [SOT-23 (TO-236)]
Q7  PNP  [SOT-23 (TO-236)]
Q8  PNP  [SOT-23 (TO-236)]
Q9  PNP  [SOT-23 (TO-236)]
R20  5.6k  [RES_0805]
R21  5.6k  [RES_0805]
R22  54.9  [RES_0805]
R23  54.9  [RES_0805]
R24  374  [RES_0805]
R25  374  [RES_0805]
R26  10K  [RES_0805]
R27  10K  [RES_0805]
R28  1K  [RES_0805]
R29  1K  [RES_0805]
R30  100K  [RES_0603]
R31  100K  [RES_0603]
R32  5.6k  [RES_0805]
R33  5.6k  [RES_0805]
R34  54.9  [RES_0805]
R35  54.9  [RES_0805]
R36  374  [RES_0805]
R37  374  [RES_0805]
R38  10K  [RES_0805]
R39  10K  [RES_0805]
R40  1K  [RES_0805]
R41  1K  [RES_0805]
R42  100K  [RES_0603]
R43  100K  [RES_0603]
R44  5.6k  [RES_0805]
R45  5.6k  [RES_0805]
R46  54.9  [RES_0805]
R47  54.9  [RES_0805]
R48  374  [RES_0805]
R49  374  [RES_0805]
R50  10K  [RES_0805]
R51  10K  [RES_0805]
R52  1K  [RES_0805]
R53  1K  [RES_0805]
R54  100K  [RES_0603]
R55  100K  [RES_0603]
R56  5.6k  [RES_0805]
R57  5.6k  [RES_0805]
R58  54.9  [RES_0805]
R59  54.9  [RES_0805]
R60  374  [RES_0805]
R61  374  [RES_0805]
R62  10K  [RES_0805]
R63  10K  [RES_0805]
R64  1K  [RES_0805]
R65  1K  [RES_0805]
R66  100K  [RES_0603]
R67  100K  [RES_0603]
U5  NPN 3.75KV  [SOIC-6]  (value not drawn)
U6  NPN 3.75KV  [SOIC-6]  (value not drawn)
U7  NPN 3.75KV  [SOIC-6]  (value not drawn)
U8  NPN 3.75KV  [SOIC-6]  (value not drawn)
U9  NPN 3.75KV  [SOIC-6]  (value not drawn)
U10  NPN 3.75KV  [SOIC-6]  (value not drawn)
U11  NPN 3.75KV  [SOIC-6]  (value not drawn)
U12  NPN 3.75KV  [SOIC-6]  (value not drawn)

### Ports
Infrared_Sens_1 (see 6[5B], 7[2A]), Infrared_Sens_1 (see 6[5B], 7[5A]), Infrared_Sens_2 (see 6[5B], 7[5A]), Infrared_Sens_2 (see 6[5B], 7[7A]), Infrared_Sens_3 (see 6[5B], 7[2B]), Infrared_Sens_3 (see 6[5B], 7[5B]), Infrared_Sens_4 (see 6[5B], 7[5B]), Infrared_Sens_4 (see 6[5B], 7[7B]), Infrared_Sens_5 (see 6[3B], 7[2B]), Infrared_Sens_5 (see 6[3B], 7[5B]), Infrared_Sens_6 (see 6[3B], 7[5B]), Infrared_Sens_6 (see 6[3B], 7[7B]), Infrared_Sens_7 (see 6[3B], 7[2C]), Infrared_Sens_7 (see 6[3B], 7[5C]), Infrared_Sens_8 (see 6[3B], 7[5C]), Infrared_Sens_8 (see 6[3B], 7[7C])

### Nets
+3.3V: R20.2 R21.2 R22.2 R23.2 R32.2 R33.2 R34.2 R35.2 R44.2 R45.2 R46.2 R47.2 R56.2 R57.2 R58.2 R59.2
+5V: JP5.1
GND: J2.1 J3.1 J4.1 J5.1 J6.1 J7.1 J8.1 J9.1 Q2.1(C) Q3.1(C) Q4.1(C) Q5.1(C) Q6.1(C) Q7.1(C) Q8.1(C) Q9.1(C) R30.2 R31.2 R42.2 R43.2 R54.2 R55.2 R66.2 R67.2 U5.3(K) U5.4(Emit) U6.3(K) U6.4(Emit) U7.3(K) U7.4(Emit) U8.3(K) U8.4(Emit) U9.3(K) U9.4(Emit) U10.3(K) U10.4(Emit) U11.3(K) U11.4(Emit) U12.3(K) U12.4(Emit)
Vin: JP5.3
Vin/+5V: J2.3 J3.3 J4.3 J5.3 J6.3 J7.3 J8.3 J9.3 JP5.2
NetD5_1: D5.1(A) R22.1
NetD5_2: D5.2(K) Q2.3(E)
NetD6_1: D6.1(A) R23.1
NetD6_2: D6.2(K) Q3.3(E)
NetD7_1: D7.1(A) R34.1
NetD7_2: D7.2(K) Q4.3(E)
NetD8_1: D8.1(A) R35.1
NetD8_2: D8.2(K) Q5.3(E)
NetD9_1: D9.1(A) R46.1
NetD9_2: D9.2(K) Q6.3(E)
NetD10_1: D10.1(A) R47.1
NetD10_2: D10.2(K) Q7.3(E)
NetD11_1: D11.1(A) R58.1
NetD11_2: D11.2(K) Q8.3(E)
NetD12_1: D12.1(A) R59.1
NetD12_2: D12.2(K) Q9.3(E)
NetJ2_2: J2.2 R24.1 R28.1
NetJ3_2: J3.2 R25.1 R29.1
NetJ4_2: J4.2 R36.1 R40.1
NetJ5_2: J5.2 R37.1 R41.1
NetJ6_2: J6.2 R48.1 R52.1
NetJ7_2: J7.2 R49.1 R53.1
NetJ8_2: J8.2 R60.1 R64.1
NetJ9_2: J9.2 R61.1 R65.1
NetQ2_2: Q2.2(B) R26.2 R30.1
NetQ3_2: Q3.2(B) R27.2 R31.1
NetQ4_2: Q4.2(B) R38.2 R42.1
NetQ5_2: Q5.2(B) R39.2 R43.1
NetQ6_2: Q6.2(B) R50.2 R54.1
NetQ7_2: Q7.2(B) R51.2 R55.1
NetQ8_2: Q8.2(B) R62.2 R66.1
NetQ9_2: Q9.2(B) R63.2 R67.1
NetR20_1: R20.1 R26.1 U5.6(Coll) ; port Infrared_Sens_1
NetR21_1: R21.1 R27.1 U6.6(Coll) ; port Infrared_Sens_2
NetR24_2: R24.2 R28.2 U5.1(A)
NetR25_2: R25.2 R29.2 U6.1(A)
NetR32_1: R32.1 R38.1 U7.6(Coll) ; port Infrared_Sens_3
NetR33_1: R33.1 R39.1 U8.6(Coll) ; port Infrared_Sens_4
NetR36_2: R36.2 R40.2 U7.1(A)
NetR37_2: R37.2 R41.2 U8.1(A)
NetR44_1: R44.1 R50.1 U9.6(Coll) ; port Infrared_Sens_5
NetR45_1: R45.1 R51.1 U10.6(Coll) ; port Infrared_Sens_6
NetR48_2: R48.2 R52.2 U9.1(A)
NetR49_2: R49.2 R53.2 U10.1(A)
NetR56_1: R56.1 R62.1 U11.6(Coll) ; port Infrared_Sens_7
NetR57_1: R57.1 R63.1 U12.6(Coll) ; port Infrared_Sens_8
NetR60_2: R60.2 R64.2 U11.1(A)
NetR61_2: R61.2 R65.2 U12.1(A)

### Notes on the sheet
- INPUT
- INPUT SELECTION
- (in symbol SCH_TITLE) Title:; Variant:; Page Contents:; Checked by; Size:; DWG NO:; Revision:; Date:; Designed by; Sheet; of

### Library data of the parts
*#5 = SCH_TITLE: Schematic information
D5-D12 = EAST16084BA8: as D13 on sheet [04] - COMMUNICATION; Category: LED Indication - Discrete; Manufacturer Part Number 1: EAST16084BA8; Case/Package: 0603 (1608 Metric); Quantity: 1; Supplier 1: Digikey; Supplier Part Number 1: 1080-1562-1-ND; Supplier Stock 1: 11914; Supplier Unit Price 1: 0.30; Supplier Currency 1: $
J2-J9 = 66200311122: CONN MALE 1X3 3MM; Manufacturer 1: Wurth Electronics Inc.; Category: Rectangular Connectors - Headers, Male Pins; Manufacturer Part Number 1: 66200311122; Case/Package: 3POS_3mmPitch; Quantity: 1; Supplier 1: Digikey; Supplier Part Number 1: 732-4709-5-ND; Supplier Order Qty 1: 1; Supplier Stock 1: 56; Supplier Unit Price 1: 0,34; Supplier Currency 1: $
JP5 = 61300311121: HDR MALE 1X3 2.54MM; Manufacturer 1: Wurth Electronics Inc.; Category: Rectangular Connectors - Headers, Male Pins; Manufacturer Part Number 1: 61300311121; Case/Package: 3POS pitch 2.54mm; Quantity: 1; Supplier 1: Digikey; Supplier Part Number 1: 732-5316-ND; Supplier Order Qty 1: 1; Supplier Stock 1: 109116; Supplier Unit Price 1: 0,13; Supplier Currency 1: $
Q2-Q9 = MMBT2907A-7-F: TRANS PNP 60V 0.6A SOT23-3; Manufacturer 1: Diodes Incorporated; Category: Transistors - Bipolar (BJT) - Single; Manufacturer Part Number 1: MMBT2907A-7-F; Case/Package: SOT-23-3; Quantity: 1; Supplier 1: Digikey; Supplier Part Number 1: MMBT2907A-FDICT-ND; Supplier Stock 1: 376417; Supplier Unit Price 1: 0.14; Supplier Currency 1: $
R20 R21 R32 R33 R44 R45 R56 R57 = ERJ-6ENF5601V: as R5 on sheet [04] - COMMUNICATION; Category: Chip Resistor - Surface Mount; Manufacturer Part Number 1: ERJ-6ENF5601V; Case/Package: 0805 (2012 Metric); Quantity: 1; Supplier 1: Digikey; Supplier Part Number 1: P5.60KCCT-ND; Supplier Order Qty 1: 1; Supplier Stock 1: 71341; Supplier Unit Price 1: 0,1; Supplier Currency 1: $
R22 R23 R34 R35 R46 R47 R58 R59 = ERJ-6ENF54R9V: RES SMD 54.9 OHM; Manufacturer 1: Panasonic Electronic Components; Category: Chip Resistor - Surface Mount; Manufacturer Part Number 1: ERJ-6ENF54R9V; Case/Package: 0805 (2012 Metric); Quantity: 1; Supplier 1: Digikey; Supplier Part Number 1: P54.9CCT-ND; Supplier Order Qty 1: 1; Supplier Stock 1: 43715; Supplier Unit Price 1: 0,1; Supplier Currency 1: $
R24 R25 R36 R37 R48 R49 R60 R61 = ERJ-6ENF3740V: RES SMD 374 OHM 1% 1/8W 0805; Manufacturer 1: Panasonic Electronic Components; Category: Chip Resistor - Surface Mount; Manufacturer Part Number 1: ERJ-6ENF3740V; Case/Package: 0805 (2012 Metric); Quantity: 1; Supplier 1: Digikey; Supplier Order Qty 1: 1; Supplier Stock 1: 100272; Supplier Unit Price 1: 0,1; Supplier Currency 1: $; Supplier Part Number 1: P374CCT-ND
R26 R27 R38 R39 R50 R51 R62 R63 = ERJ-6ENF1002V: as R72 on sheet [04] - COMMUNICATION; Category: Chip Resistor - Surface Mount; Manufacturer Part Number 1: ERJ-6ENF1002V; Case/Package: 0805 (2012 Metric); Quantity: 1; Supplier 1: Digikey; Supplier Part Number 1: P10.0KCCT-ND; Supplier Order Qty 1: 1; Supplier Stock 1: 2515107; Supplier Unit Price 1: 0,1; Supplier Currency 1: $
R28 R29 R40 R41 R52 R53 R64 R65 = ERJ-6ENF1001V: as R4 on sheet [04] - COMMUNICATION; Category: Chip Resistor - Surface Mount; Manufacturer Part Number 1: ERJ-6ENF1001V; Case/Package: 0805 (2012 Metric); Quantity: 1; Supplier 1: Digikey; Supplier Part Number 1: P1.00KCCT-ND; Supplier Order Qty 1: 1; Supplier Stock 1: 1361018; Supplier Unit Price 1: 0,1; Supplier Currency 1: $
R30 R31 R42 R43 R54 R55 R66 R67 = ERJ-PA3J104V: RES SMD 100K 5% 1/4W 0603; Manufacturer 1: Panasonic Electronic Components; Category: Chip Resistor - Surface Mount; Manufacturer Part Number 1: ERJ-PA3J104V; Case/Package: 0603 (1608 Metric); Quantity: 1; Supplier 1: Digikey; Supplier Part Number 1: P100KBZCT-ND; Supplier Order Qty 1: 1; Supplier Stock 1: 11465; Supplier Unit Price 1: 0,11; Supplier Currency 1: $
U5-U12 = TLP2301(TPL,E: OPTOISO 3.75KV TRANS; Manufacturer 1: Toshiba Semiconductor and Storage; Category: Optoisolators - Transistor, Photovoltaic Output; Manufacturer Part Number 1: TLP2301(TPL,E; Case/Package: 6-SOIC (0.179", 4.55mm Width), 4 Leads; Quantity: 1; Supplier 1: Digikey; Supplier Part Number 1: TLP2301(TPLECT-ND; Supplier Order Qty 1: 1; Supplier Stock 1: 19225; Supplier Unit Price 1: 0,73; Supplier Currency 1: $

## Sheet [08] - OUTPUT.SchDoc
size A3; DocumentNumber: 8; SheetNumber: 8; SheetTotal: 10
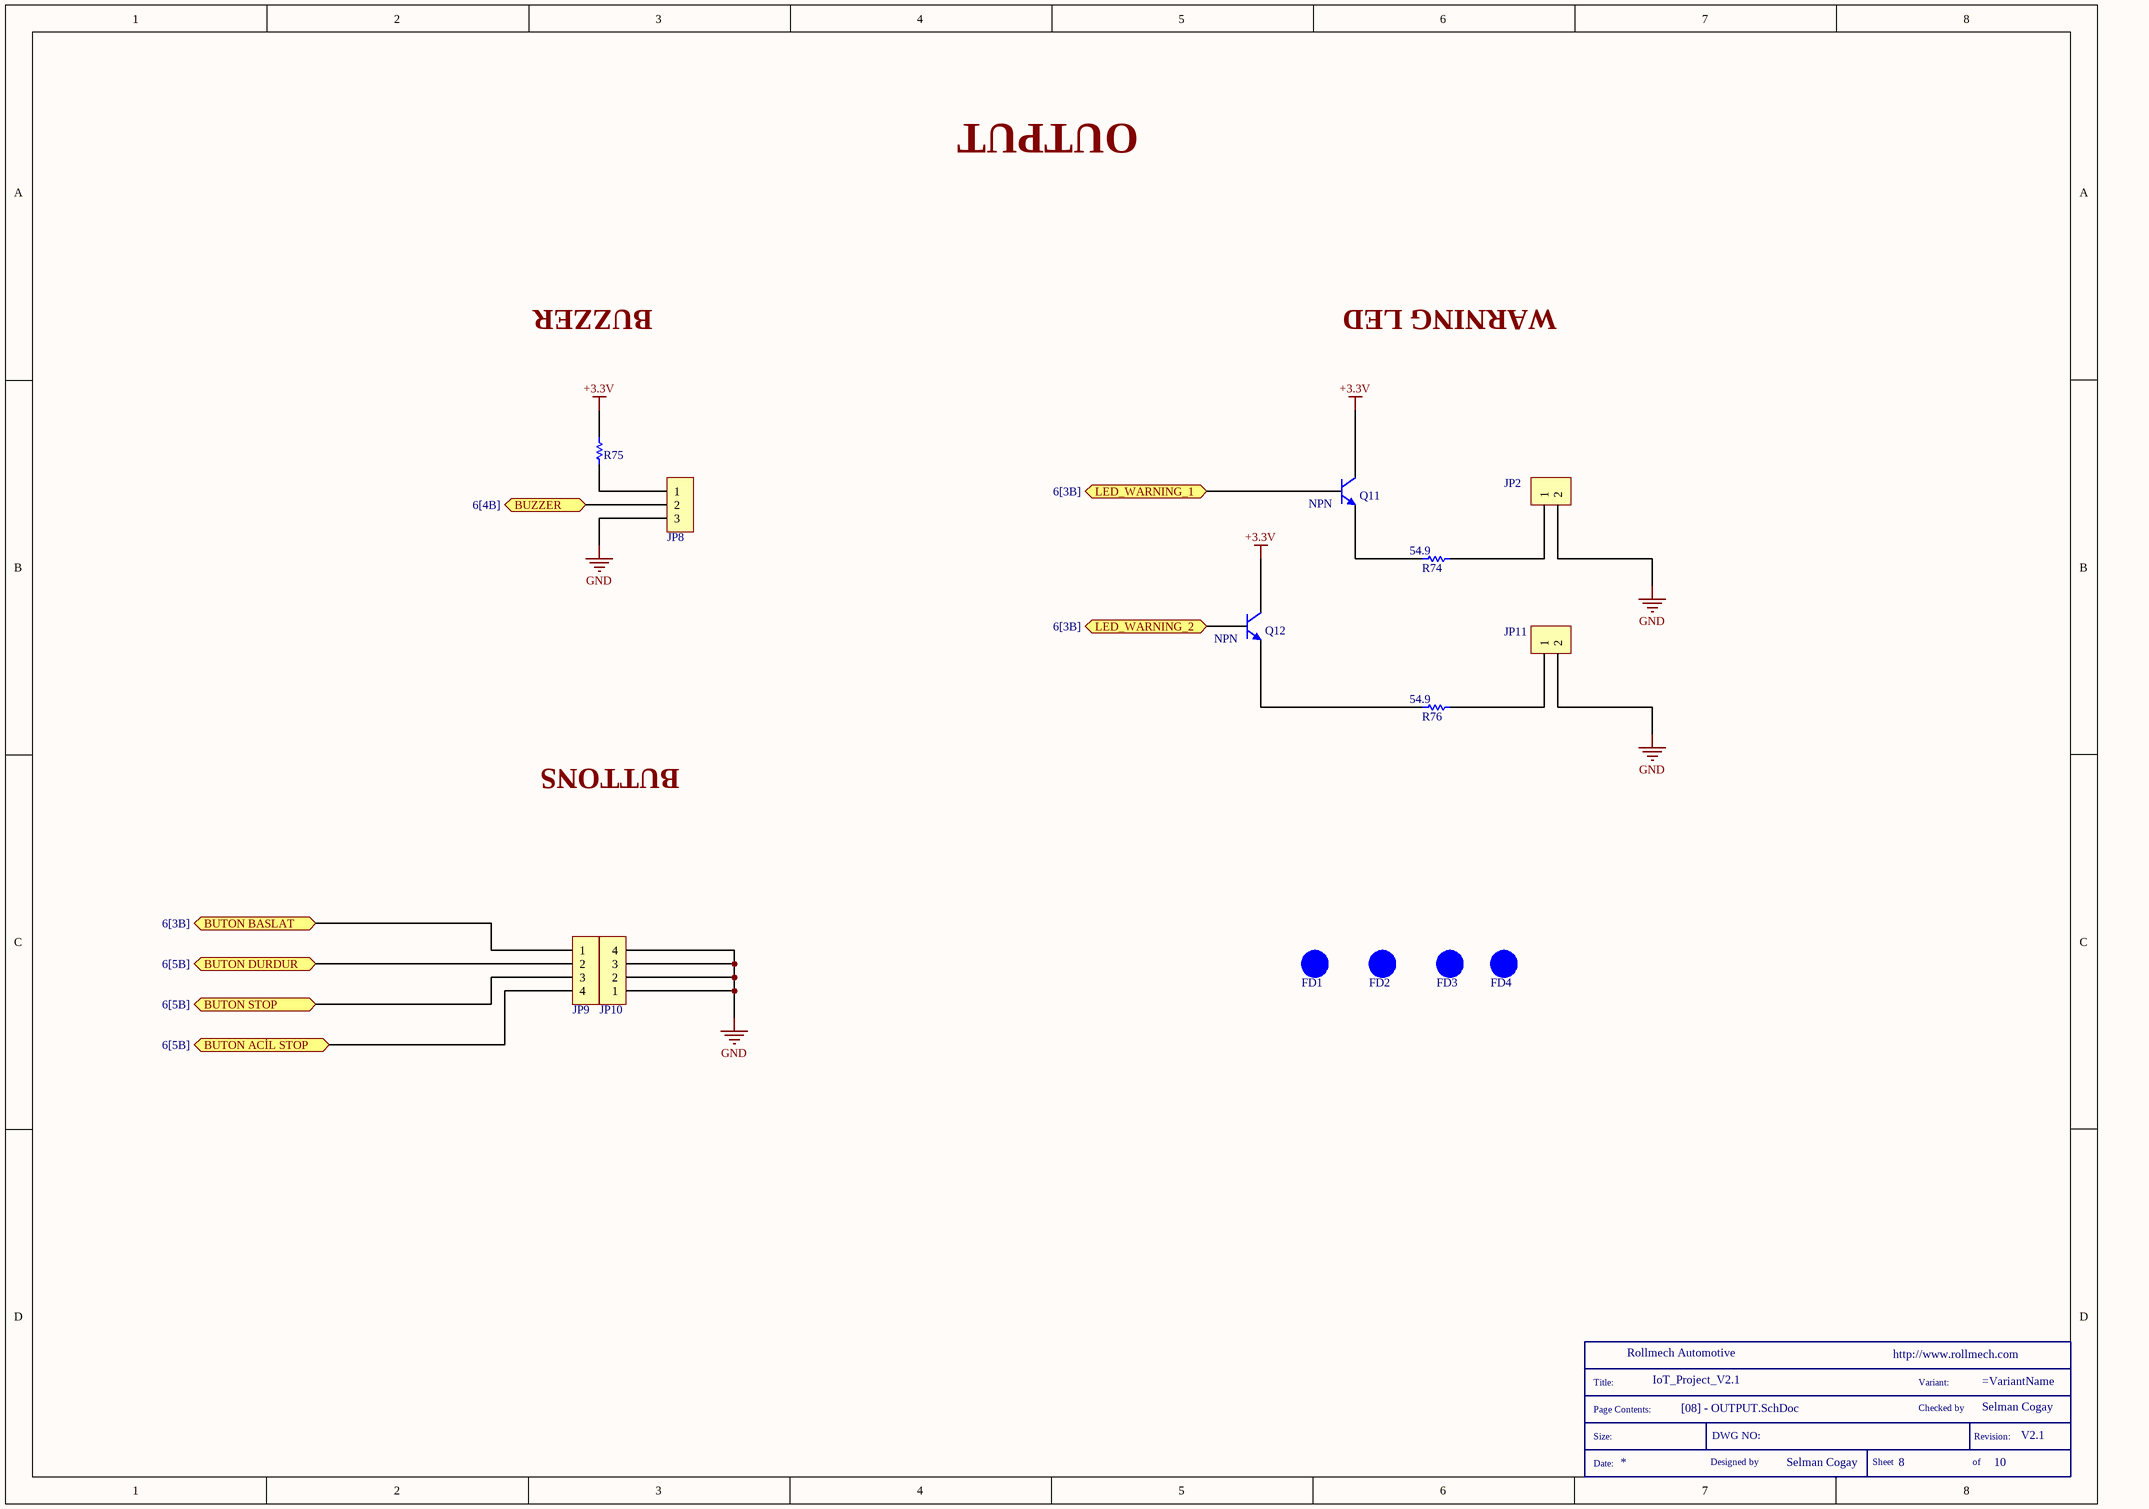
[diagram p5: [08] - OUTPUT.SchDoc]

### Parts
(Parts that share a designator on the sheet are numbered #1, #2 ... from top to bottom, then left to right.)
*#6  SCH_TITLE  (value not drawn)  (graphical)
FD1  FID_1MMC  [FID_40x120D]  (value not drawn)  (no BOM)
FD2  FID_1MMC  [FID_40x120D]  (value not drawn)  (no BOM)
FD3  FID_1MMC  [FID_40x120D]  (value not drawn)  (no BOM)
FD4  FID_1MMC  [FID_40x120D]  (value not drawn)  (no BOM)
JP2  HDR 1X2 2.54MM  [HDR_FEMALE_1X2_2.54MM]  (value not drawn)
JP8  HDR_1X3_2.54  [HDR_MALE_1X3_2.54MM]  (value not drawn)
JP9  HDR FEMALE 1X4 2.54MM  [HDR_FEMALE_1X4_2.54MM]  (value not drawn)
JP10  HDR FEMALE 1X4 2.54MM  [HDR_FEMALE_1X4_2.54MM]  (value not drawn)
JP11  HDR 1X2 2.54MM  [HDR_FEMALE_1X2_2.54MM]  (value not drawn)
Q11  NPN  [SOT-23 (TO-236)]
Q12  NPN  [SOT-23 (TO-236)]
R74  54.9  [RES_0805]
R75  0 1/8W  [RES_0805]  (value not drawn)
R76  54.9  [RES_0805]

### Ports
BUTON ACİL STOP (see 6[5B]), BUTON BASLAT (see 6[3B]), BUTON DURDUR (see 6[5B]), BUTON STOP (see 6[5B]), BUZZER (see 6[4B]), LED_WARNING_1 (see 6[3B]), LED_WARNING_2 (see 6[3B])

### Nets
+3.3V: Q11.1(C) Q12.1(C) R75.2
GND: JP2.2 JP8.3 JP10.1 JP10.2 JP10.3 JP10.4 JP11.2
NetJP2_1: JP2.1 R74.2
NetJP8_1: JP8.1 R75.1
NetJP8_2: JP8.2 ; port BUZZER
NetJP9_1: JP9.1 ; port BUTON BASLAT
NetJP9_2: JP9.2 ; port BUTON DURDUR
NetJP9_3: JP9.3 ; port BUTON STOP
NetJP9_4: JP9.4 ; port BUTON ACİL STOP
NetJP11_1: JP11.1 R76.2
NetQ11_2: Q11.2(B) ; port LED_WARNING_1
NetQ11_3: Q11.3(E) R74.1
NetQ12_2: Q12.2(B) ; port LED_WARNING_2
NetQ12_3: Q12.3(E) R76.1

### Notes on the sheet
- OUTPUT
- BUZZER
- WARNING LED
- BUTTONS
- (in symbol SCH_TITLE) Title:; Variant:; Page Contents:; Checked by; Size:; DWG NO:; Revision:; Date:; Designed by; Sheet; of

### Library data of the parts
*#6 = SCH_TITLE: Schematic information
FD1-FD4 = FID_1MMC: Fiducial 40 mil diameter , 120 mil mask
JP2 JP11 = PPTC021LFBN-RC: as JP1 on sheet [04] - COMMUNICATION; Category: Rectangular Connectors - Headers, Receptacles, Female Sockets; Manufacturer Part Number 1: PPTC021LFBN-RC; Case/Package: 2POS_2.54mmPitch; Quantity: 1; Supplier 1: Digikey; Supplier Part Number 1: S7000-ND; Supplier Order Qty 1: 1; Supplier Stock 1: 46723; Supplier Unit Price 1: 0,32; Supplier Currency 1: $
JP8 = 61300311121: as JP5 on sheet [07] - INPUT; Category: Rectangular Connectors - Headers, Male Pins; Manufacturer Part Number 1: 61300311121; Case/Package: 3POS pitch 2.54mm; Quantity: 1; Supplier 1: Digikey; Supplier Part Number 1: 732-5316-ND; Supplier Order Qty 1: 1; Supplier Stock 1: 109116; Supplier Unit Price 1: 0,13; Supplier Currency 1: $
JP9 JP10 = PPTC041LFBN-RC: as JP12 on sheet [04] - COMMUNICATION; Category: Rectangular Connectors - Headers, Receptacles, Female Sockets; Case/Package: 4POS_2.54mmPitch; Manufacturer Part Number 1: PPTC041LFBN-RC; Quantity: 1; Supplier 1: Digikey; Supplier Part Number 1: S7002-ND; Supplier Order Qty 1: 1; Supplier Stock 1: 30769; Supplier Unit Price 1: 0,45; Supplier Currency 1: $
Q11 Q12 = MMBT2222A-7-F: as Q10 on sheet [04] - COMMUNICATION; Category: Transistors - Bipolar (BJT) - Single; Manufacturer Part Number 1: MMBT2222A-7-F; Case/Package: SOT-23-3; Quantity: 1; Supplier 1: Digikey; Supplier Part Number 1: MMBT2222A-FDICT-ND; Supplier Order Qty 1: 1; Supplier Stock 1: 1957039; Supplier Unit Price 1: 0,14; Supplier Currency 1: $
R74 R76 = ERJ-6ENF54R9V: as R22 on sheet [07] - INPUT; Category: Chip Resistor - Surface Mount; Manufacturer Part Number 1: ERJ-6ENF54R9V; Case/Package: 0805 (2012 Metric); Quantity: 1; Supplier 1: Digikey; Supplier Part Number 1: P54.9CCT-ND; Supplier Order Qty 1: 1; Supplier Stock 1: 43715; Supplier Unit Price 1: 0,1; Supplier Currency 1: $
R75 = CRCW08050000Z0EA": as R6 on sheet [05] - LCD-EEPROM-RTC; Case/Package: 0805 (2012 Metric); Manufacturer Part Number 1: CRCW08050000Z0EA; Category: Chip Resistor - Surface Mount; Quantity: 1; Supplier 1: Digikey; Supplier Part Number 1: 541-0.0ACT-ND; Supplier Stock 1: 746599; Supplier Unit Price 1: 0.1; Supplier Currency 1: $

## Sheet [09] - SENSOR.SchDoc
size A3; DocumentNumber: 9; SheetNumber: 9; SheetTotal: 10
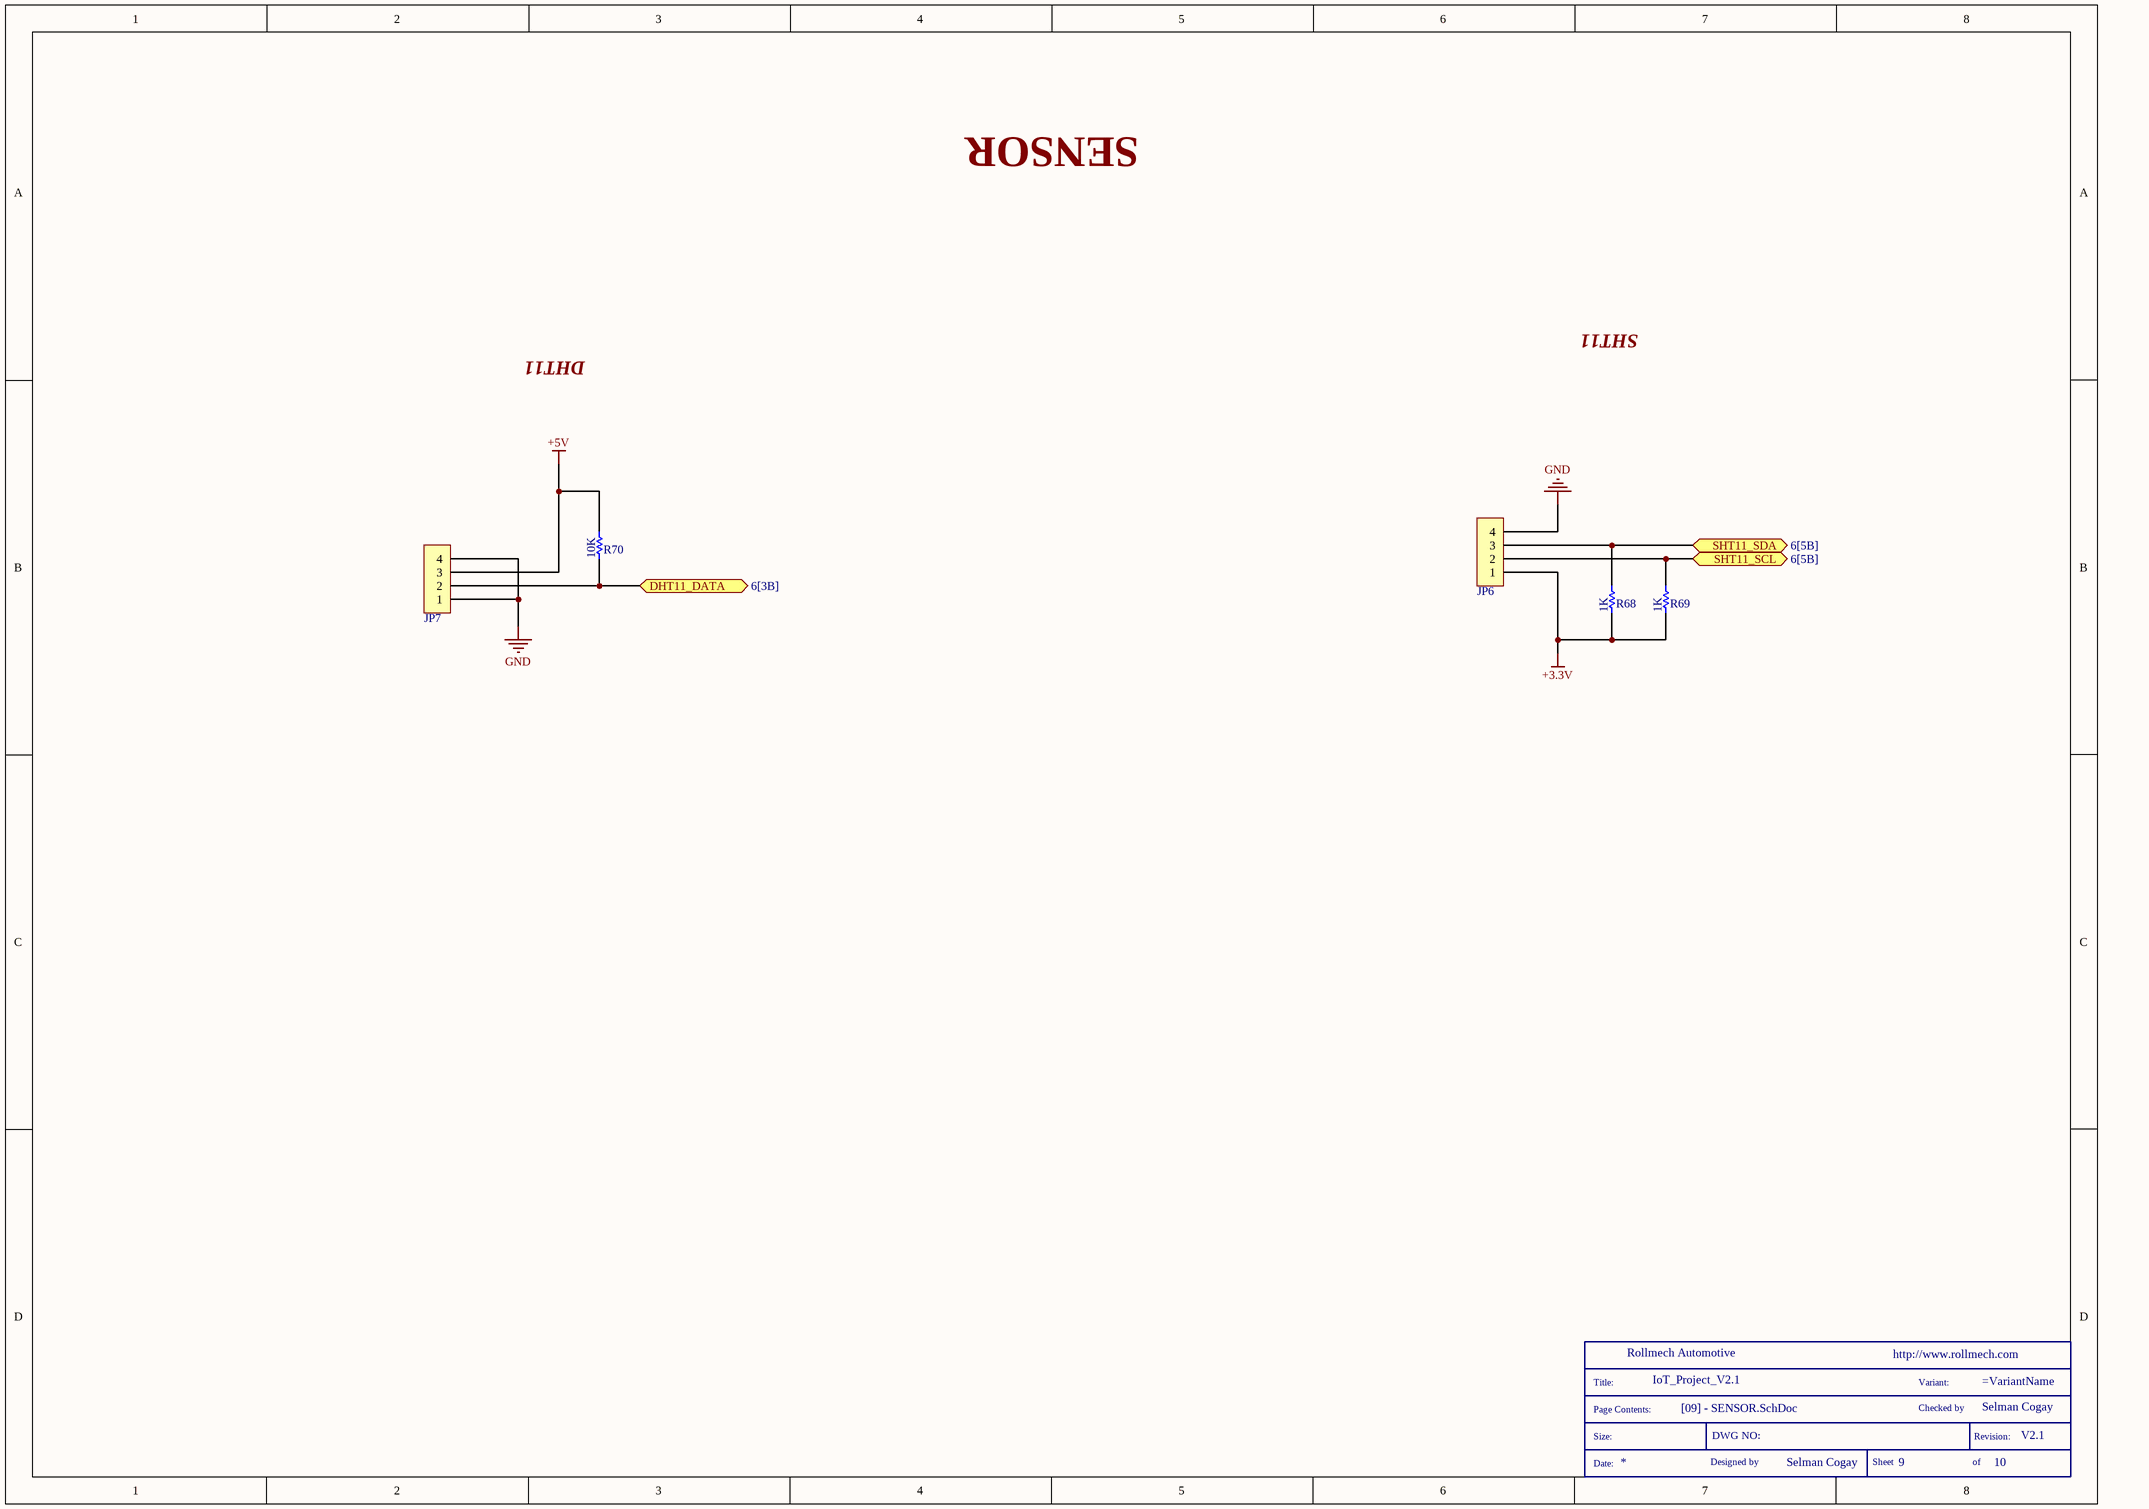
[diagram p6: [09] - SENSOR.SchDoc]

### Parts
(Parts that share a designator on the sheet are numbered #1, #2 ... from top to bottom, then left to right.)
*#7  SCH_TITLE  (value not drawn)  (graphical)
JP6  HDR FEMALE 1X4 2.54MM  [HDR_FEMALE_1X4_2.54MM]  (value not drawn)
JP7  HDR FEMALE 1X4 2.54MM  [HDR_FEMALE_1X4_2.54MM]  (value not drawn)
R68  1K  [RES_0805]
R69  1K  [RES_0805]
R70  10K  [RES_0805]

### Ports
DHT11_DATA (see 6[3B]), SHT11_SCL (see 6[5B]), SHT11_SDA (see 6[5B])

### Nets
+3.3V: JP6.1 R68.2 R69.2
+5V: JP7.3 R70.2
GND: JP6.4 JP7.1 JP7.4
NetJP6_2: JP6.2 R69.1 ; port SHT11_SCL
NetJP6_3: JP6.3 R68.1 ; port SHT11_SDA
NetJP7_2: JP7.2 R70.1 ; port DHT11_DATA

### Notes on the sheet
- SENSOR
- DHT11
- SHT11
- (in symbol SCH_TITLE) Title:; Variant:; Page Contents:; Checked by; Size:; DWG NO:; Revision:; Date:; Designed by; Sheet; of

### Library data of the parts
*#7 = SCH_TITLE: Schematic information
JP6 JP7 = PPTC041LFBN-RC: as JP12 on sheet [04] - COMMUNICATION; Category: Rectangular Connectors - Headers, Receptacles, Female Sockets; Case/Package: 4POS_2.54mmPitch; Manufacturer Part Number 1: PPTC041LFBN-RC; Quantity: 1; Supplier 1: Digikey; Supplier Part Number 1: S7002-ND; Supplier Order Qty 1: 1; Supplier Stock 1: 30769; Supplier Unit Price 1: 0,45; Supplier Currency 1: $
R68 R69 = ERJ-6ENF1001V: as R4 on sheet [04] - COMMUNICATION; Category: Chip Resistor - Surface Mount; Manufacturer Part Number 1: ERJ-6ENF1001V; Case/Package: 0805 (2012 Metric); Quantity: 1; Supplier 1: Digikey; Supplier Part Number 1: P1.00KCCT-ND; Supplier Order Qty 1: 1; Supplier Stock 1: 1361018; Supplier Unit Price 1: 0,1; Supplier Currency 1: $
R70 = ERJ-6ENF1002V: as R72 on sheet [04] - COMMUNICATION; Category: Chip Resistor - Surface Mount; Manufacturer Part Number 1: ERJ-6ENF1002V; Case/Package: 0805 (2012 Metric); Quantity: 1; Supplier 1: Digikey; Supplier Part Number 1: P10.0KCCT-ND; Supplier Order Qty 1: 1; Supplier Stock 1: 2515107; Supplier Unit Price 1: 0,1; Supplier Currency 1: $

## Nets that join several sheets
+3.3V: [04] - COMMUNICATION (6 pins), [06] - MCU (16 pins), [07] - INPUT (16 pins), [08] - OUTPUT (Q11.1 Q12.1 R75.2), [09] - SENSOR (JP6.1 R68.2 R69.2)
+5V: [04] - COMMUNICATION (C8.2 C9.2 C10.2), [05] - LCD-EEPROM-RTC (6 pins), [07] - INPUT (JP5.1), [09] - SENSOR (JP7.3 R70.2)
GND: [04] - COMMUNICATION (17 pins), [05] - LCD-EEPROM-RTC (10 pins), [06] - MCU (17 pins), [07] - INPUT (40 pins), [08] - OUTPUT (7 pins), [09] - SENSOR (JP6.4 JP7.1 JP7.4)
NetJP4_4: [05] - LCD-EEPROM-RTC (JP4.4), [06] - MCU (U4.59)
NetJP4_6: [05] - LCD-EEPROM-RTC (JP4.6), [06] - MCU (U4.58)
NetJP6_2: [06] - MCU (U4.29), [09] - SENSOR (JP6.2 R69.1)
NetJP6_3: [06] - MCU (U4.30), [09] - SENSOR (JP6.3 R68.1)
NetJP7_2: [06] - MCU (U4.8), [09] - SENSOR (JP7.2 R70.1)
NetJP8_2: [06] - MCU (U4.2), [08] - OUTPUT (JP8.2)
NetJP9_1: [06] - MCU (U4.25), [08] - OUTPUT (JP9.1)
NetJP9_2: [06] - MCU (U4.26), [08] - OUTPUT (JP9.2)
NetJP9_3: [06] - MCU (U4.27), [08] - OUTPUT (JP9.3)
NetJP9_4: [06] - MCU (U4.28), [08] - OUTPUT (JP9.4)
NetJP12_1: [04] - COMMUNICATION (JP12.1 JP13.4 U2.36), [06] - MCU (U4.15)
NetJP12_2: [04] - COMMUNICATION (JP12.2 JP13.3 U2.35), [06] - MCU (U4.17)
NetJP12_3: [04] - COMMUNICATION (JP12.3 JP13.2 U2.34), [06] - MCU (U4.16)
NetJP12_4: [04] - COMMUNICATION (JP12.4 JP13.1 U2.33), [06] - MCU (U4.14)
NetQ11_2: [06] - MCU (U4.9), [08] - OUTPUT (Q11.2)
NetQ12_2: [06] - MCU (U4.10), [08] - OUTPUT (Q12.2)
NetR6_1: [05] - LCD-EEPROM-RTC (R6.1), [06] - MCU (U4.57)
NetR7_1: [05] - LCD-EEPROM-RTC (R7.1), [06] - MCU (U4.56)
NetR8_1: [05] - LCD-EEPROM-RTC (R8.1), [06] - MCU (U4.55)
NetR9_1: [05] - LCD-EEPROM-RTC (R9.1), [06] - MCU (U4.54)
NetR10_1: [04] - COMMUNICATION (R10.1), [06] - MCU (U4.49)
NetR11_1: [04] - COMMUNICATION (R11.1), [06] - MCU (U4.46)
NetR12_1: [04] - COMMUNICATION (R12.1), [06] - MCU (R19.1 R81.1 S2.1 U4.7)
NetR13_2: [05] - LCD-EEPROM-RTC (R13.2 U3.6), [06] - MCU (U4.61)
NetR14_2: [05] - LCD-EEPROM-RTC (R14.2 U3.5), [06] - MCU (U4.62)
NetR16_2: [05] - LCD-EEPROM-RTC (R16.2), [06] - MCU (U4.3)
NetR17_2: [05] - LCD-EEPROM-RTC (R17.2), [06] - MCU (U4.4)
NetR20_1: [06] - MCU (U4.33), [07] - INPUT (R20.1 R26.1 U5.6)
NetR21_1: [06] - MCU (U4.34), [07] - INPUT (R21.1 R27.1 U6.6)
NetR32_1: [06] - MCU (U4.35), [07] - INPUT (R32.1 R38.1 U7.6)
NetR33_1: [06] - MCU (U4.36), [07] - INPUT (R33.1 R39.1 U8.6)
NetR44_1: [06] - MCU (U4.37), [07] - INPUT (R44.1 R50.1 U9.6)
NetR45_1: [06] - MCU (U4.38), [07] - INPUT (R45.1 R51.1 U10.6)
NetR56_1: [06] - MCU (U4.39), [07] - INPUT (R56.1 R62.1 U11.6)
NetR57_1: [06] - MCU (U4.40), [07] - INPUT (R57.1 R63.1 U12.6)
NetR72_2: [04] - COMMUNICATION (R72.2 U1.3), [06] - MCU (U4.42)
NetR73_1: [04] - COMMUNICATION (R73.1), [06] - MCU (U4.11)
NetR77_1: [05] - LCD-EEPROM-RTC (R77.1), [06] - MCU (U4.53)
NetR78_1: [05] - LCD-EEPROM-RTC (R78.1), [06] - MCU (U4.52)
NetR79_1: [05] - LCD-EEPROM-RTC (R79.1), [06] - MCU (U4.51)
NetR80_1: [05] - LCD-EEPROM-RTC (R80.1), [06] - MCU (U4.50)
NetU1_2: [04] - COMMUNICATION (U1.2), [06] - MCU (U4.43)
NetU1_9: [04] - COMMUNICATION (U1.9), [06] - MCU (U4.41)
NetU1_12: [04] - COMMUNICATION (U1.12), [06] - MCU (U4.44)
NetU1_16: [04] - COMMUNICATION (U1.16), [06] - MCU (U4.45)
NetU2_13: [04] - COMMUNICATION (U2.13), [06] - MCU (U4.20)
NetU2_14: [04] - COMMUNICATION (U2.14), [06] - MCU (U4.21)
NetU2_16: [04] - COMMUNICATION (U2.16), [06] - MCU (U4.22)
NetU2_23: [04] - COMMUNICATION (U2.23), [06] - MCU (U4.23)